# Altium project MBoard.PrjPcb (part 1 of 2)
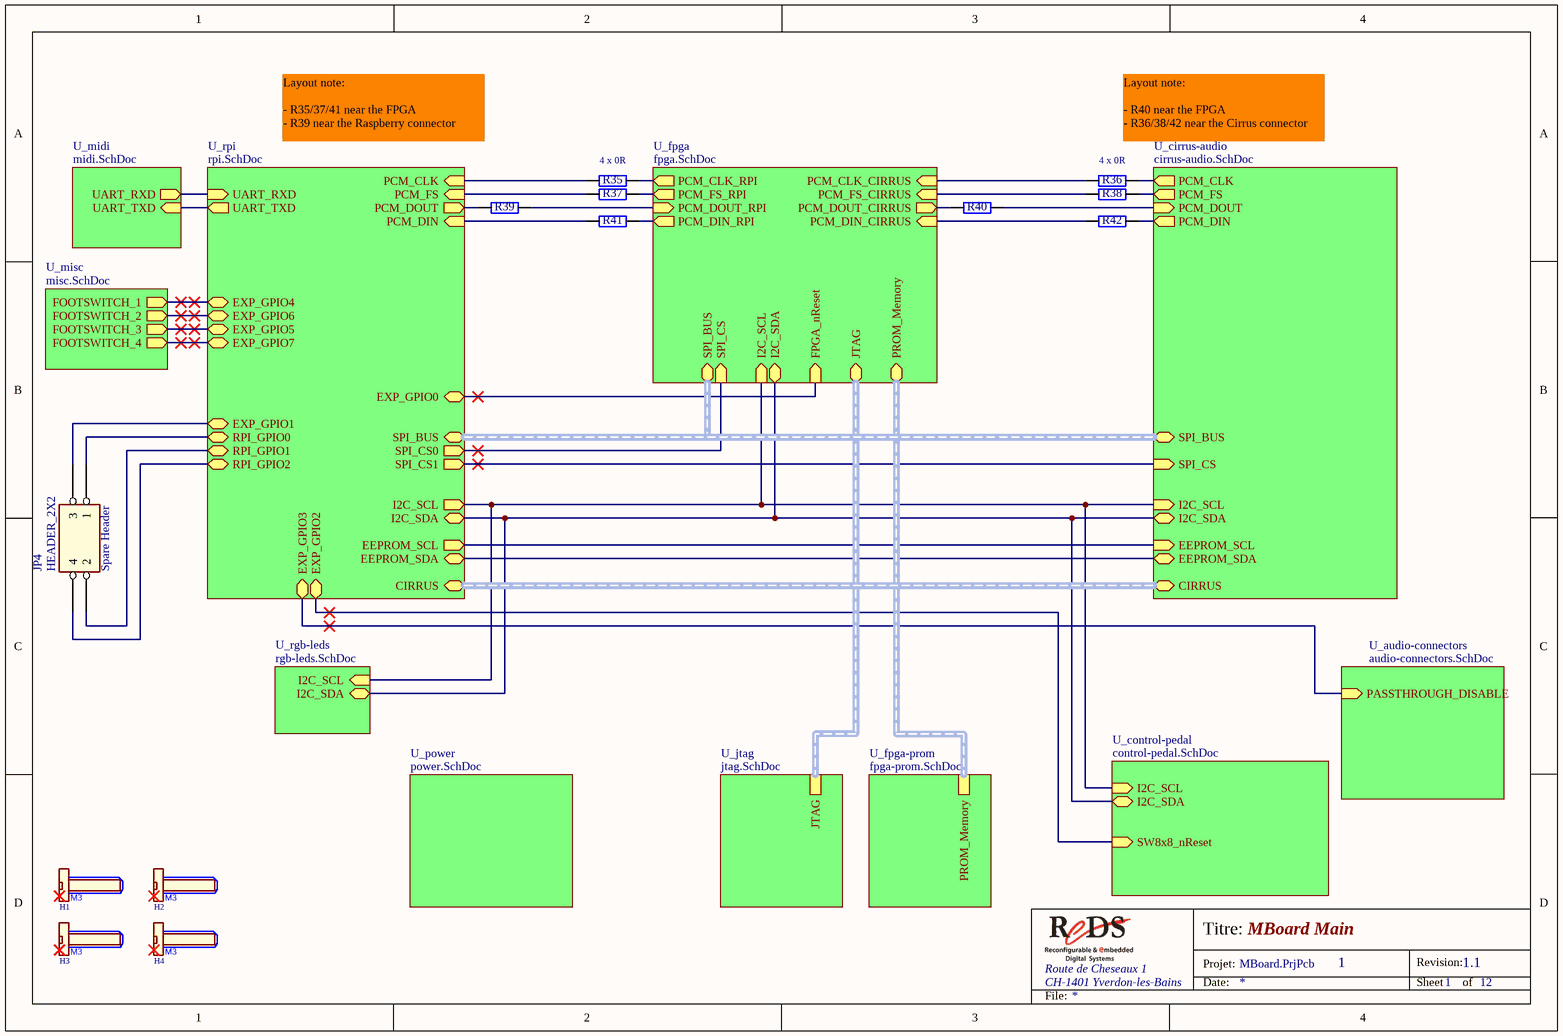
[diagram p0: mboard.SchDoc]
12 sheets, 202 parts. Net scope: hierarchical (ports join the sheet entries above them; power ports are global).
Board file: MBoard.PcbDoc
Sheets:
  mboard.SchDoc
    U_rpi = rpi.SchDoc
    U_fpga = fpga.SchDoc
    U_cirrus-audio = cirrus-audio.SchDoc
    U_midi = midi.SchDoc
    U_power = power.SchDoc
    U_control-pedal = control-pedal.SchDoc
    U_fpga-prom = fpga-prom.SchDoc
    U_jtag = jtag.SchDoc
    U_misc = misc.SchDoc
    U_audio-connectors = audio-connectors.SchDoc
    U_rgb-leds = rgb-leds.SchDoc

## Sheet mboard.SchDoc: MBoard Main
size A4; Organization: heig-vd; Address1: heig-vd; Address2: Route de Cheseaux 1; Address3: 1401 Yverdon-les-Bains; Address4: Suisse; DocumentNumber: 1; Revision: 1.1; SheetNumber: 1; SheetTotal: 12

### Parts
H1  M3  [HOLE_3.2MM - No Plated]  (value not drawn)  (no BOM)
H2  M3  [HOLE_3.2MM - No Plated]  (value not drawn)  (no BOM)
H3  M3  [HOLE_3.2MM - No Plated]  (value not drawn)  (no BOM)
H4  M3  [HOLE_3.2MM - No Plated]  (value not drawn)  (no BOM)
JP4  HEADER_2X2  [BLKCON.100/VH/TM2OE/W.200/2]  (no BOM)
R35  0R  [SM/R_0603]  (value not drawn)
R36  0R  [SM/R_0603]  (value not drawn)
R37  0R  [SM/R_0603]  (value not drawn)
R38  0R  [SM/R_0603]  (value not drawn)
R39  0R  [SM/R_0603]  (value not drawn)
R40  0R  [SM/R_0603]  (value not drawn)
R41  0R  [SM/R_0603]  (value not drawn)
R42  0R  [SM/R_0603]  (value not drawn)

### Sub-sheets
U_audio-connectors = audio-connectors.SchDoc: PASSTHROUGH_DISABLE (in)
U_cirrus-audio = cirrus-audio.SchDoc: I2C_SDA (bidir), I2C_SCL (in), SPI_CS (in), PCM_DIN (out), PCM_DOUT (in), EEPROM_SDA (bidir), EEPROM_SCL (in), CIRRUS (harness CIRRUS_CTL), SPI_BUS (harness SPI), PCM_FS (out), PCM_CLK (out)
U_control-pedal = control-pedal.SchDoc: I2C_SDA (bidir), I2C_SCL (in), SW8x8_nReset (in)
U_fpga = fpga.SchDoc: I2C_SDA (bidir), I2C_SCL (in), SPI_CS (in), PCM_DIN_RPI (out), PCM_DOUT_RPI (in), PCM_DIN_CIRRUS (in), PCM_DOUT_CIRRUS (out), FPGA_nReset (in), JTAG (harness JTAG), PROM_Memory (harness PROM_Memory), SPI_BUS (harness SPI), PCM_FS_CIRRUS (in), PCM_CLK_RPI (out), PCM_CLK_CIRRUS (in), PCM_FS_RPI (out)
U_fpga-prom = fpga-prom.SchDoc: PROM_Memory (harness PROM_Memory)
U_jtag = jtag.SchDoc: JTAG (harness JTAG)
U_midi = midi.SchDoc: UART_TXD (in), UART_RXD (out)
U_misc = misc.SchDoc: FOOTSWITCH_1 (out), FOOTSWITCH_2 (out), FOOTSWITCH_4 (out), FOOTSWITCH_3 (out)
U_power = power.SchDoc: no entries
U_rgb-leds = rgb-leds.SchDoc: I2C_SCL (in), I2C_SDA (bidir)
U_rpi = rpi.SchDoc: EEPROM_SDA (bidir), UART_RXD (in), UART_TXD (out), PCM_DOUT (out), I2C_SDA (bidir), I2C_SCL (out), SPI_CS0 (out), SPI_CS1 (out), EEPROM_SCL (out), PCM_DIN (in), EXP_GPIO1 (bidir), EXP_GPIO2 (bidir), EXP_GPIO0 (bidir), EXP_GPIO3 (bidir), EXP_GPIO4 (bidir), EXP_GPIO5 (bidir), EXP_GPIO6 (bidir), EXP_GPIO7 (bidir), SPI_BUS (harness SPI), PCM_CLK (in), PCM_FS (in), CIRRUS (harness CIRRUS_CTL), RPI_GPIO2 (bidir), RPI_GPIO0 (bidir), RPI_GPIO1 (bidir)

### Nets
FPGA_nReset: sheet U_rpi/EXP_GPIO0, sheet U_fpga/FPGA_nReset
I2C_SCL: sheet U_rpi/I2C_SCL, sheet U_fpga/I2C_SCL, sheet U_cirrus-audio/I2C_SCL, sheet U_control-pedal/I2C_SCL, sheet U_rgb-leds/I2C_SCL
I2C_SDA: sheet U_rpi/I2C_SDA, sheet U_fpga/I2C_SDA, sheet U_cirrus-audio/I2C_SDA, sheet U_control-pedal/I2C_SDA, sheet U_rgb-leds/I2C_SDA
SW8x8_nReset: sheet U_rpi/EXP_GPIO2, sheet U_control-pedal/SW8x8_nReset
NetD12_2: sheet U_rpi/EXP_GPIO4, sheet U_misc/FOOTSWITCH_1
NetD13_2: sheet U_rpi/EXP_GPIO6, sheet U_misc/FOOTSWITCH_2
NetD14_2: sheet U_rpi/EXP_GPIO5, sheet U_misc/FOOTSWITCH_3
NetD15_2: sheet U_rpi/EXP_GPIO7, sheet U_misc/FOOTSWITCH_4
NetJ1_8: sheet U_rpi/UART_TXD, sheet U_midi/UART_TXD
NetJ1_10: sheet U_rpi/UART_RXD, sheet U_midi/UART_RXD
NetJ1_12: R35.1 ; sheet U_rpi/PCM_CLK
NetJ1_26: sheet U_rpi/SPI_CS1, sheet U_cirrus-audio/SPI_CS
NetJ1_29: JP4.2 ; sheet U_rpi/RPI_GPIO1
NetJ1_31: sheet U_rpi/SPI_CS0, sheet U_fpga/SPI_CS
NetJ1_32: JP4.1 ; sheet U_rpi/RPI_GPIO0
NetJ1_35: R37.1 ; sheet U_rpi/PCM_FS
NetJ1_36: JP4.4 ; sheet U_rpi/RPI_GPIO2
NetJ1_38: R41.1 ; sheet U_rpi/PCM_DIN
NetJ1_40: R39.1 ; sheet U_rpi/PCM_DOUT
NetJ2_12: R36.2 ; sheet U_cirrus-audio/PCM_CLK
NetJ2_27: sheet U_rpi/EEPROM_SDA, sheet U_cirrus-audio/EEPROM_SDA
NetJ2_28: sheet U_rpi/EEPROM_SCL, sheet U_cirrus-audio/EEPROM_SCL
NetJ2_35: R38.2 ; sheet U_cirrus-audio/PCM_FS
NetJ2_38: R42.2 ; sheet U_cirrus-audio/PCM_DIN
NetJ2_40: R40.2 ; sheet U_cirrus-audio/PCM_DOUT
NetJP4_3: JP4.3 ; sheet U_rpi/EXP_GPIO1
NetQ3_1: sheet U_rpi/EXP_GPIO3, sheet U_audio-connectors/PASSTHROUGH_DISABLE
NetR35_2: R35.2 ; sheet U_fpga/PCM_CLK_RPI
NetR36_1: R36.1 ; sheet U_fpga/PCM_CLK_CIRRUS
NetR37_2: R37.2 ; sheet U_fpga/PCM_FS_RPI
NetR38_1: R38.1 ; sheet U_fpga/PCM_FS_CIRRUS
NetR39_2: R39.2 ; sheet U_fpga/PCM_DOUT_RPI
NetR40_1: R40.1 ; sheet U_fpga/PCM_DOUT_CIRRUS
NetR41_2: R41.2 ; sheet U_fpga/PCM_DIN_RPI
NetR42_1: R42.1 ; sheet U_fpga/PCM_DIN_CIRRUS

Not connected (* = marked no-connect by the designer): H1 1(EARTH)*; H2 1(EARTH)*; H3 1(EARTH)*; H4 1(EARTH)*

### Buses and harness runs
harness sheet U_cirrus-audio/CIRRUS = sheet U_rpi/CIRRUS
harness sheet U_cirrus-audio/SPI_BUS = sheet U_fpga/SPI_BUS = sheet U_rpi/SPI_BUS
harness sheet U_fpga-prom/PROM_Memory = sheet U_fpga/PROM_Memory
harness sheet U_fpga/JTAG = sheet U_jtag/JTAG

### Notes on the sheet
- Layout note:
  - R35/37/41 near the FPGA
  - R39 near the Raspberry connector
- (near R35) 4 x 0R
- (near R36) 4 x 0R
- Layout note:
  - R40 near the FPGA
  - R36/38/42 near the Cirrus connector
- (near JP4) Spare Header
- Route de Cheseaux 1
- CH-1401 Yverdon-les-Bains
- Titre:
- Date:
- Projet:
- Revision:
- Sheet
- of
- File:

### Library data of the parts
H1-H4 = 143: Trou de fixation 3.2mm non métalisé pour vis M3; ID: 143; Component Type: Fixation M3; Value: M3; ComponentLink1Description: Datasheet; ComponentLink2Description: Supplier; RoHS Compliant1: False
JP4 = 71: Barrette double 2x2 poles 2.54mm; Manufacturer: TE Connectivity; Manufacturer P/N: 5-826632-0; ID: 71; Connector Type: Barrette 2.54mm; Component Type: Barrette 2.54mm; Supplier 1: Distrelec; Supplier Part Number 1: 122363; ComponentLink1Description: Datasheet; ComponentLink1URL: #https://www.distrelec.ch/ishop/Datasheets/eh826629_draw.pdf#; ComponentLink2Description: Supplier; ComponentLink2URL: https://www.distrelec.ch/barrette-%C3%A0-broches-50-p%C3%B4les-1p-x50/te-connectivity/5-826629-0/122354/fr; RoHS Compliant1: False
R35-R42 = 2128: Résistance 0603 100mW 1% 0R; Manufacturer: VISHAY DRALORIC; Manufacturer P/N: CRCW06030000Z0EA; ID: 2128; Voltage: 75V; Value: 0R; Component Type: Résistance; Power: 100mW; Tolerance: 1%; Supplier 1: Digi-Key; Supplier Part Number 1: 541-0.0GTR-ND; Supplier 2: Mouser; Supplier Part Number 2: 71-CRCW0603-0-E3; RoHS Compliant: True; ComponentLink1Description: Datasheet; ComponentLink1URL: #http://www.mouser.com/ds/2/427/dcrcwe3-109170.pdf#; ComponentLink2Description: Supplier; ComponentLink2URL: #http://www.digikey.fr/product-detail/fr/ERJ-2GE0R00X/P0.0JCT-ND/146726#

## Sheet rpi.SchDoc: Raspberry PI Interface
size A4; Organization: heig-vd; Address1: heig-vd; Address2: Route de Cheseaux 1; Address3: 1401 Yverdon-les-Bains; Address4: Suisse; DocumentNumber: 2; Revision: 1.1; SheetNumber: 2; SheetTotal: 12
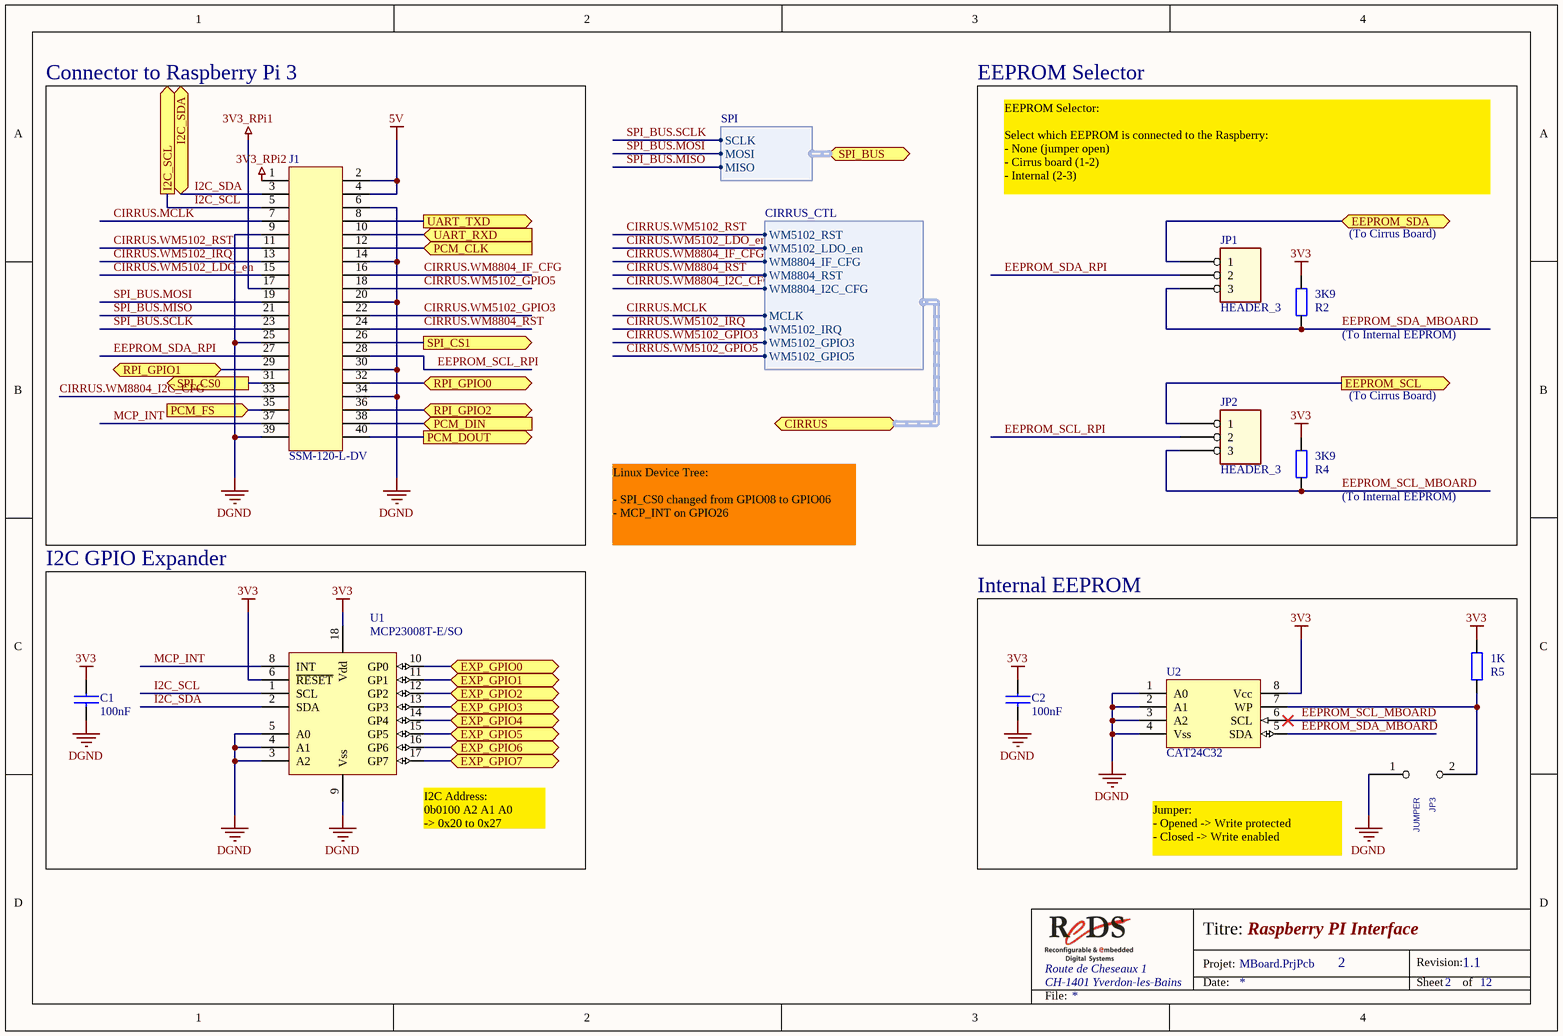
[diagram p1: rpi.SchDoc]

### Parts
C1  100nF  [SM/C_0603]
C2  100nF  [SM/C_0603]
J1  SSM-120-L-DV  [SSM-120]
JP1  HEADER_3  [BLKCON.100/VH/TM1SQ/W.100/3]
JP2  HEADER_3  [BLKCON.100/VH/TM1SQ/W.100/3]
JP3  JUMPER  [BLKCON.100/VH/TM1SQ/W.100/2]
R2  3K9  [SM/R_0603]
R4  3K9  [SM/R_0603]
R5  1K  [SM/R_0603]
U1  MCP23008T-E/SO  [SOIC-18 - W]
U2  CAT24C32  [SOIC-8 - N]

### Blocks framed on the sheet
Connector to Raspberry Pi 3: J1
EEPROM Selector: JP1 JP2 R2 R4
I2C GPIO Expander: C1 U1
Internal EEPROM: C2 JP3 R5 U2

### Ports
CIRRUS (harness CIRRUS_CTL), EEPROM_SCL (out), EEPROM_SDA (bidir), EXP_GPIO0 (bidir), EXP_GPIO1 (bidir), EXP_GPIO2 (bidir), EXP_GPIO3 (bidir), EXP_GPIO4 (bidir), EXP_GPIO5 (bidir), EXP_GPIO6 (bidir), EXP_GPIO7 (bidir), I2C_SCL (out), I2C_SDA (bidir), PCM_CLK (in), PCM_DIN (in), PCM_DOUT (out), PCM_FS (in), RPI_GPIO0 (bidir), RPI_GPIO1 (bidir), RPI_GPIO2 (bidir), SPI_BUS (harness SPI), SPI_CS0 (out), SPI_CS1 (out), UART_RXD (in), UART_TXD (out)

### Harnesses
CIRRUS_CTL: WM5102_RST, WM5102_LDO_en, WM8804_IF_CFG, WM8804_RST, WM8804_I2C_CFG, MCLK, WM5102_IRQ, WM5102_GPIO3, WM5102_GPIO5
SPI: SCLK, MOSI, MISO

### Nets
3V3: C1.1 C2.1 R2.1 R4.1 R5.1 U1.6(~{RESET}) U1.18(Vdd) U2.8(Vcc)
3V3_RPi1: J1.17
3V3_RPi2: J1.1
5V: J1.2 J1.4
DGND: C1.2 C2.2 J1.6 J1.9 J1.14 J1.20 J1.25 J1.30 J1.34 J1.39 JP3.1 U1.3(A2) U1.4(A1) U1.5(A0) U1.9(Vss) U2.1(A0) U2.2(A1) U2.3(A2) U2.4(Vss)
CIRRUS.MCLK: J1.7 ; port CIRRUS.MCLK
CIRRUS.WM5102_GPIO3: J1.22 ; port CIRRUS.WM5102_GPIO3
CIRRUS.WM5102_GPIO5: J1.18 ; port CIRRUS.WM5102_GPIO5
CIRRUS.WM5102_IRQ: J1.13 ; port CIRRUS.WM5102_IRQ
CIRRUS.WM5102_LDO_en: J1.15 ; port CIRRUS.WM5102_LDO_en
CIRRUS.WM5102_RST: J1.11 ; port CIRRUS.WM5102_RST
CIRRUS.WM8804_I2C_CFG: J1.33 ; port CIRRUS.WM8804_I2C_CFG
CIRRUS.WM8804_IF_CFG: J1.16 ; port CIRRUS.WM8804_IF_CFG
CIRRUS.WM8804_RST: J1.24 ; port CIRRUS.WM8804_RST
EEPROM_SCL_MBOARD: JP2.3 R4.2 U2.6(SCL)
EEPROM_SCL_RPI: J1.28 JP2.2
EEPROM_SDA_MBOARD: JP1.3 R2.2 U2.5(SDA)
EEPROM_SDA_RPI: J1.27 JP1.2
FPGA_nReset: U1.10(GP0) ; port EXP_GPIO0
I2C_SCL: J1.5 U1.1(SCL) ; port I2C_SCL
I2C_SDA: J1.3 U1.2(SDA) ; port I2C_SDA
MCP_INT: J1.37 U1.8(INT)
SPI_BUS.MISO: J1.21 ; port SPI_BUS.MISO
SPI_BUS.MOSI: J1.19 ; port SPI_BUS.MOSI
SPI_BUS.SCLK: J1.23 ; port SPI_BUS.SCLK
SW8x8_nReset: U1.12(GP2) ; port EXP_GPIO2
NetD12_2: U1.14(GP4) ; port EXP_GPIO4
NetD13_2: U1.16(GP6) ; port EXP_GPIO6
NetD14_2: U1.15(GP5) ; port EXP_GPIO5
NetD15_2: U1.17(GP7) ; port EXP_GPIO7
NetJ1_8: J1.8 ; port UART_TXD
NetJ1_10: J1.10 ; port UART_RXD
NetJ1_12: J1.12 ; port PCM_CLK
NetJ1_26: J1.26 ; port SPI_CS1
NetJ1_29: J1.29 ; port RPI_GPIO1
NetJ1_31: J1.31 ; port SPI_CS0
NetJ1_32: J1.32 ; port RPI_GPIO0
NetJ1_35: J1.35 ; port PCM_FS
NetJ1_36: J1.36 ; port RPI_GPIO2
NetJ1_38: J1.38 ; port PCM_DIN
NetJ1_40: J1.40 ; port PCM_DOUT
NetJ2_27: JP1.1 ; port EEPROM_SDA
NetJ2_28: JP2.1 ; port EEPROM_SCL
NetJP3_2: JP3.2 R5.2 U2.7(WP)
NetJP4_3: U1.11(GP1) ; port EXP_GPIO1
NetQ3_1: U1.13(GP3) ; port EXP_GPIO3

### Notes on the sheet
- EEPROM Selector:
  Select which EEPROM is connected to the Raspberry:
  - None (jumper open)
  - Cirrus board (1-2)
  - Internal (2-3)
- (To Cirrus Board)
- (near R2) (To Internal EEPROM)
- (near R4) (To Internal EEPROM)
- Linux Device Tree:
  - SPI_CS0 changed from GPIO08 to GPIO06
  - MCP_INT on GPIO26
- (near U1) I2C Address:
  0b0100 A2 A1 A0
  -> 0x20 to 0x27
- Jumper:
  - Opened -> Write protected
  - Closed -> Write enabled
- Route de Cheseaux 1
- CH-1401 Yverdon-les-Bains
- Titre:
- Date:
- Projet:
- Revision:
- Sheet
- of
- File:

### Library data of the parts
C1 C2 = 182: Ceramic multi-layer; Manufacturer: AVX; Manufacturer P/N: 0603YC104KAZ2A; ID: 182; Voltage: 16V; Tolerance: ±10%; Value: 100nF; Component Type: Capacitor, non-polarized; Supplier 1: Farnell; Supplier Part Number 1: 7569556; RoHS Compliant: True
J1 = SSM-120-L-DV: Mating (female) connector for the RPi 3
JP1 JP2 = 41: Barrette simple 3 poles 2.54mm; Manufacturer: TE Connectivity; Manufacturer P/N: 5-826629-0; ID: 41; Connector Type: Barrette 2.54mm; Component Type: Barrette 2.54mm; Supplier 1: Distrelec; Supplier Part Number 1: 122354; ComponentLink1Description: Datasheet; ComponentLink1URL: #https://www.distrelec.ch/ishop/Datasheets/eh826629_draw.pdf#; ComponentLink2Description: Supplier; ComponentLink2URL: https://www.distrelec.ch/barrette-%C3%A0-broches-50-p%C3%B4les-1p-x50/te-connectivity/5-826629-0/122354/fr; RoHS Compliant1: False
JP3 = 102: Barrette simple 2 poles 2.54mm; Manufacturer: TE Connectivity; Manufacturer P/N: 5-826629-0; ID: 102; Connector Type: Barrette 2.54mm; Component Type: Jumper; Supplier 1: Distrelec; Supplier Part Number 1: 122354; ComponentLink1Description: Datasheet; ComponentLink1URL: #https://www.distrelec.ch/ishop/Datasheets/eh826629_draw.pdf#; ComponentLink2Description: Supplier; ComponentLink2URL: https://www.distrelec.ch/barrette-%C3%A0-broches-50-p%C3%B4les-1p-x50/te-connectivity/5-826629-0/122354/fr; RoHS Compliant1: False
R2 R4 = 123: Résistance 0603 63mW 1% 3K9; Manufacturer: Multicomp; Manufacturer P/N: MC 0.036mW 0603 1% 3K9; ID: 123; Voltage: 50V; Value: 3K9; Component Type: Résistance; Power: 63mW; Tolerance: 1%; Supplier 1: Farnell; Supplier Part Number 1: 9331140; RoHS Compliant: False
R5 = 109: Résistance 0603 63mW 1% 1K; Manufacturer: Multicomp; Manufacturer P/N: MC 0.036mW 0603 1% 1K; ID: 109; Voltage: 50V; Value: 1K; Component Type: Résistance; Power: 63mW; Tolerance: 1%; Supplier 1: Farnell; Supplier Part Number 1: 9330380; RoHS Compliant: False
U1 = MCP23008T-E/SO: 8-Bit I/O Expander with Serial Interface (SOIC); Supplier 1: Mouser; Supplier 2: Farnell; Supplier 3: Digi-Key; Supplier 4: Arrow; Supplier Part Number 1: 579-MCP23008T-E/SO; Supplier Part Number 2: 1332086; Supplier Part Number 3: MCP23008T-E/SODKR-ND; Supplier Part Number 4: z9HrPUYC-Z_kvHyipgUSB4v0Qz4-3ABI9jppHtpV0FM
U2 = CAT24C32W: 32-Kb I2C CMOS Serial  EEPROM; Supplier 1: Farnell; Supplier 2: Mouser; Supplier 3: Newark; Supplier 4: Digi-Key; Supplier 5: Digi-Key; Supplier 6: Digi-Key; Supplier 7: Newark; Supplier 8: Farnell; Supplier 9: Arrow; Supplier 10: Mouser; Supplier 11: Arrow; Supplier Part Number 1: 1718129; Supplier Part Number 2: 698-CAT24C32WI-GT3; Supplier Part Number 3: 08R5414; Supplier Part Number 4: CAT24C32WI-GT3CT-ND; Supplier Part Number 5: CAT24C32WI-GOS-ND; Supplier Part Number 6: CAT24C32WI-GT3DKR-ND; Supplier Part Number 7: 06R0560; Supplier Part Number 8: 1631139; Supplier Part Number 9: VnlsYlhtkEtjJb7ddmB954M0cIWzK2n6cXeSPF3m92I; Supplier Part Number 10: 698-CAT24C32WI-G; Supplier Part Number 11: VnlsYlhtkEtjJb7ddmB95zFhSL4MLJyM6Ic6OekJsHY

## Sheet fpga.SchDoc: FPGA (Spartan 6)
size A3; Author: GAA; Organization: heig-vd; Address1: heig-vd; Address2: Route de Cheseaux 1; Address3: 1401 Yverdon-les-Bains; Address4: Suisse; DocumentNumber: 4; Revision: 1.1; SheetNumber: 4; SheetTotal: 12
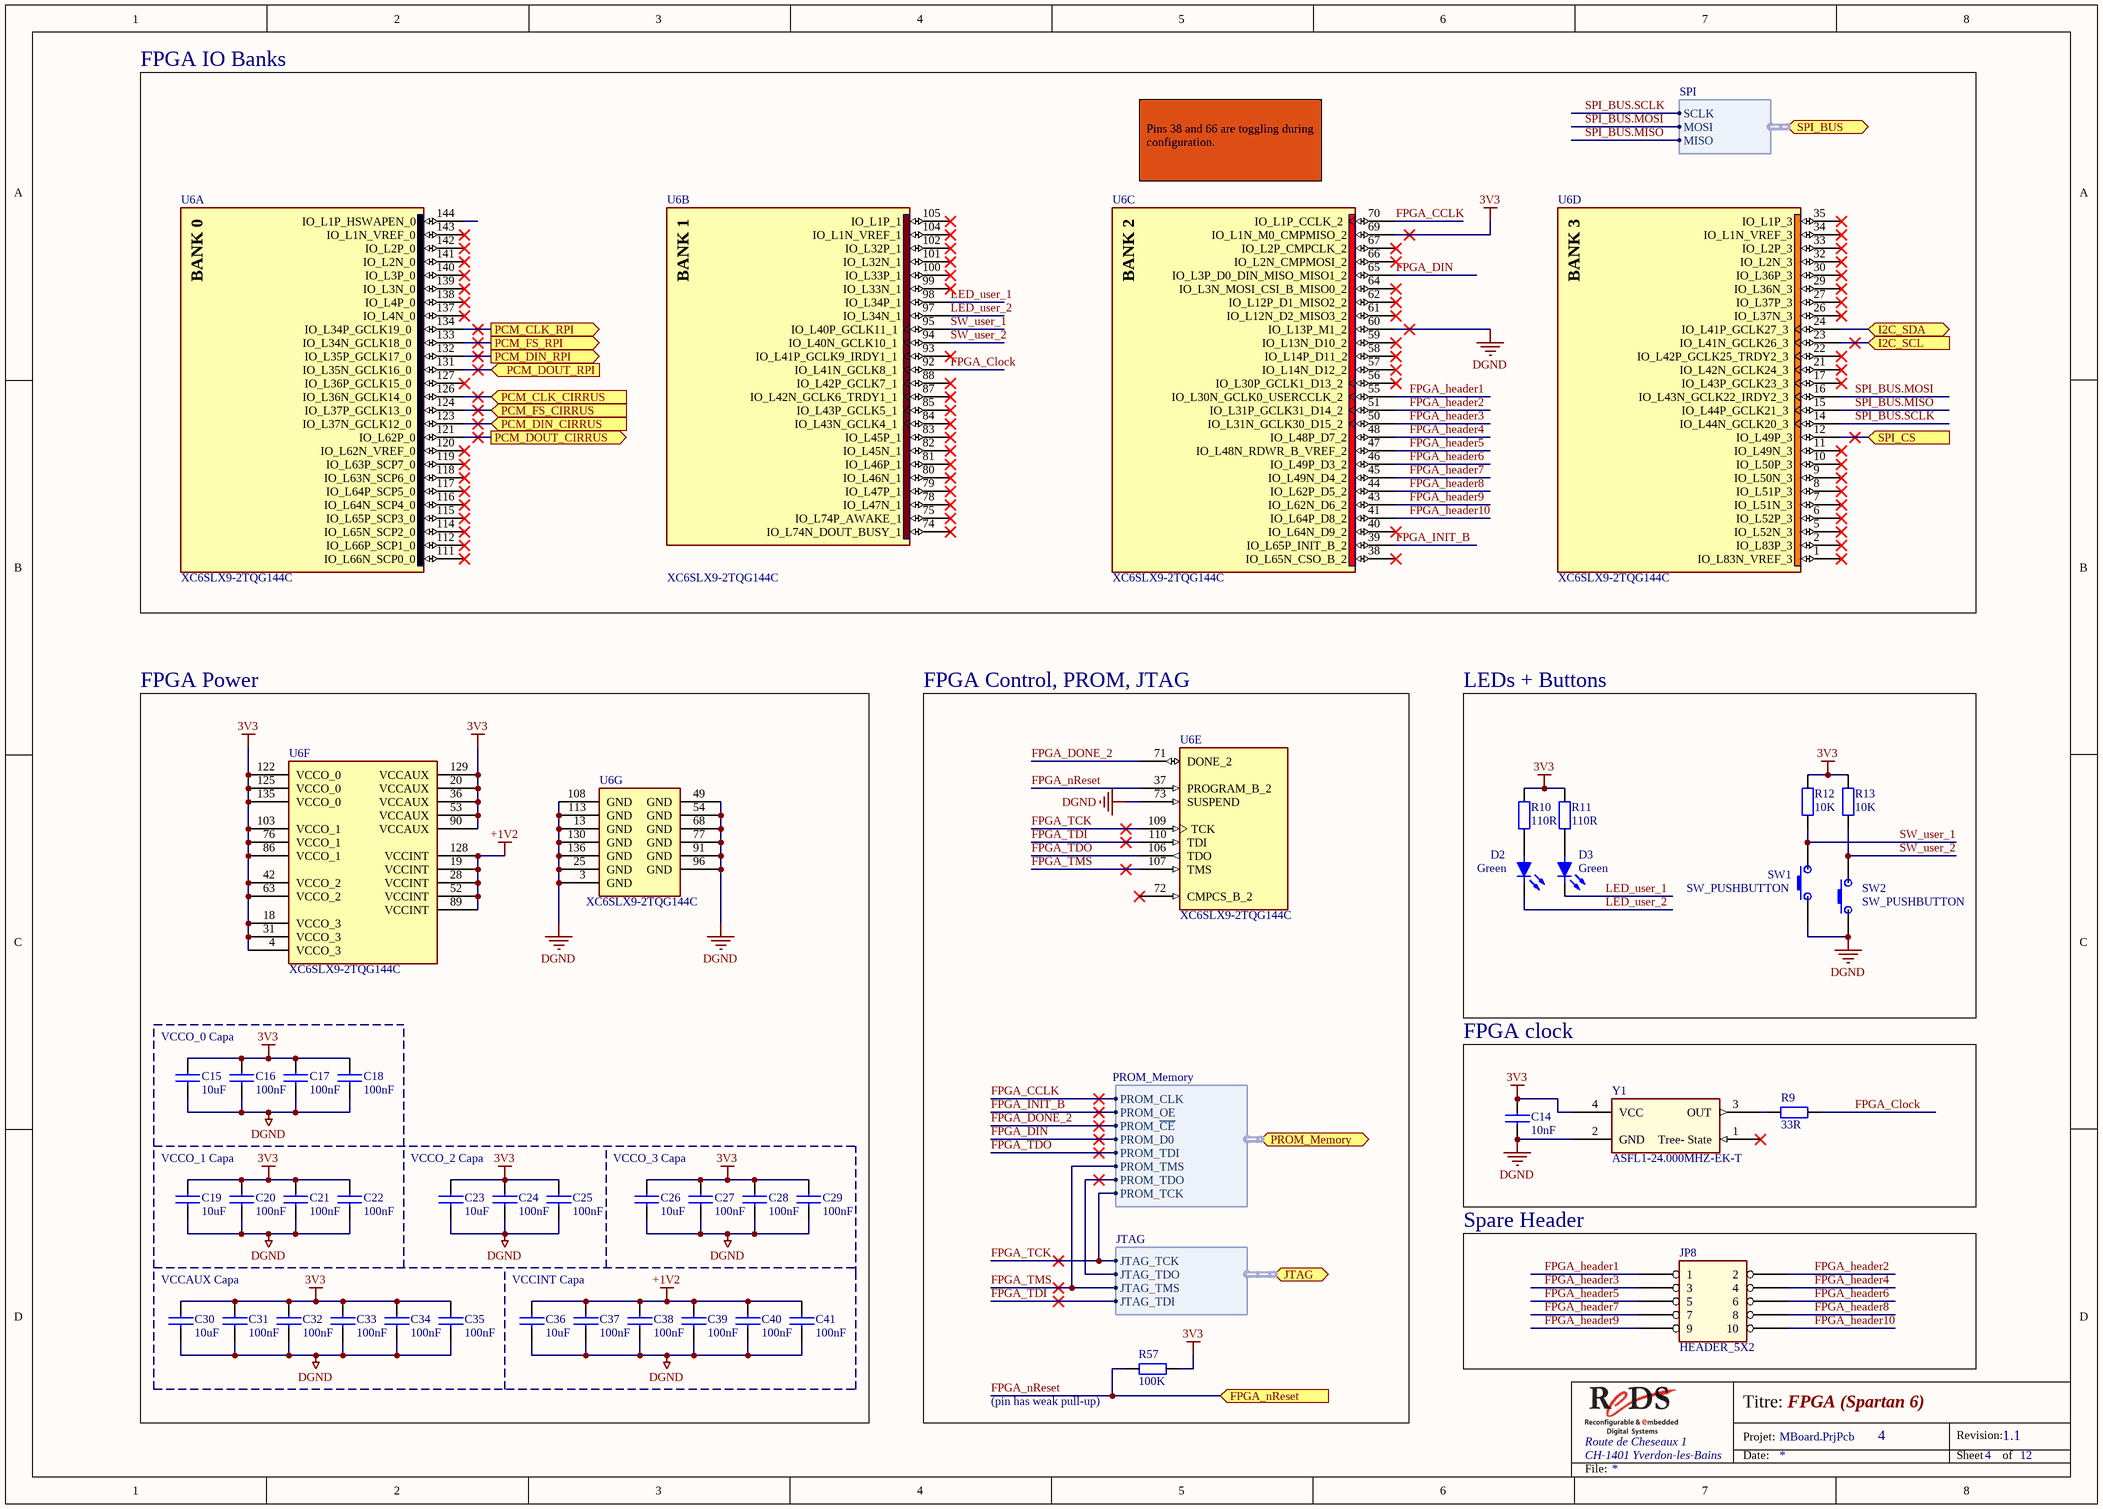
[diagram p2: fpga.SchDoc]

### Parts
C14  10nF  [SM/C_0603]
C15  10uF  [SM/C_1206]
C16  100nF  [SM/C_0603]
C17  100nF  [SM/C_0603]
C18  100nF  [SM/C_0603]
C19  10uF  [SM/C_1206]
C20  100nF  [SM/C_0603]
C21  100nF  [SM/C_0603]
C22  100nF  [SM/C_0603]
C23  10uF  [SM/C_1206]
C24  100nF  [SM/C_0603]
C25  100nF  [SM/C_0603]
C26  10uF  [SM/C_1206]
C27  100nF  [SM/C_0603]
C28  100nF  [SM/C_0603]
C29  100nF  [SM/C_0603]
C30  10uF  [SM/C_1206]
C31  100nF  [SM/C_0603]
C32  100nF  [SM/C_0603]
C33  100nF  [SM/C_0603]
C34  100nF  [SM/C_0603]
C35  100nF  [SM/C_0603]
C36  10uF  [SM/C_1206]
C37  100nF  [SM/C_0603]
C38  100nF  [SM/C_0603]
C39  100nF  [SM/C_0603]
C40  100nF  [SM/C_0603]
C41  100nF  [SM/C_0603]
D2  value Green  [PLCC_2]  (hidden comment: HSMG-A100-J02J1)
D3  value Green  [PLCC_2]  (hidden comment: HSMG-A100-J02J1)
JP8  HEADER_5X2  [BLKCON.100/VH/TM2OE/W.200/10]  (no BOM)
R9  33R  [SM/R_0603]
R10  110R  [SM/R_0603]
R11  110R  [SM/R_0603]
R12  10K  [SM/R_0603]
R13  10K  [SM/R_0603]
R57  100K  [SM/R_0603]
SW1  SW_PUSHBUTTON  [TE Connectivity_SWITCH_SERIES-FSMSM]
SW2  SW_PUSHBUTTON  [TE Connectivity_SWITCH_SERIES-FSMSM]
U6  XC6SLX9-2TQG144C  [TQFP-144]  (parts A,B,C,D,E,F,G of 7)
Y1  Manufacturer P/N: ASFL1-24.000MHZ-EK-T  [ABRACON_OSCILLATOR_ASFL1 SERIES]  (hidden comment: OSCILLATOR_2)

### Blocks framed on the sheet
FPGA IO Banks: U6
FPGA Power: C15-C41 U6
FPGA Control, PROM, JTAG: R57 U6
LEDs + Buttons: D2 D3 R10-R13 SW1 SW2
FPGA clock: C14 R9 Y1
Spare Header: JP8

### Ports
FPGA_nReset (in), I2C_SCL (in), I2C_SDA (bidir), JTAG (harness JTAG), PCM_CLK_CIRRUS (in), PCM_CLK_RPI (out), PCM_DIN_CIRRUS (in), PCM_DIN_RPI (out), PCM_DOUT_CIRRUS (out), PCM_DOUT_RPI (in), PCM_FS_CIRRUS (in), PCM_FS_RPI (out), PROM_Memory (harness PROM_Memory), SPI_BUS (harness SPI), SPI_CS (in)

### Harnesses
JTAG: JTAG_TCK, JTAG_TDI, JTAG_TDO, JTAG_TMS
PROM_Memory: PROM_CLK, PROM_OE, PROM_~{CE}, PROM_D0, PROM_TDI, PROM_TDO, PROM_TCK, PROM_TMS
SPI: SCLK, MOSI, MISO

### Nets
3V3: C14.1 C15.1 C16.1 C17.1 C18.1 C19.1 C20.1 C21.1 C22.1 C23.1 C24.1 C25.1 C26.1 C27.1 C28.1 C29.1 C30.1 C31.1 C32.1 C33.1 C34.1 C35.1 R10.1 R11.1 R12.1 R13.1 R57.2 U6.4(VCCO_3) U6.18(VCCO_3) U6.20(VCCAUX) U6.31(VCCO_3) U6.36(VCCAUX) U6.42(VCCO_2) U6.53(VCCAUX) U6.63(VCCO_2) U6.69(IO_L1N_M0_CMPMISO_2) U6.76(VCCO_1) U6.86(VCCO_1) U6.90(VCCAUX) U6.103(VCCO_1) U6.122(VCCO_0) U6.125(VCCO_0) U6.129(VCCAUX) U6.135(VCCO_0) Y1.4(VCC)
+1V2: C36.1 C37.1 C38.1 C39.1 C40.1 C41.1 U6.19(VCCINT) U6.28(VCCINT) U6.52(VCCINT) U6.89(VCCINT) U6.128(VCCINT)
DGND: C14.2 C15.2 C16.2 C17.2 C18.2 C19.2 C20.2 C21.2 C22.2 C23.2 C24.2 C25.2 C26.2 C27.2 C28.2 C29.2 C30.2 C31.2 C32.2 C33.2 C34.2 C35.2 C36.2 C37.2 C38.2 C39.2 C40.2 C41.2 SW1.1 SW2.1 U6.3(GND) U6.13(GND) U6.25(GND) U6.49(GND) U6.54(GND) U6.60(IO_L13P_M1_2) U6.68(GND) U6.73(SUSPEND) U6.77(GND) U6.91(GND) U6.96(GND) U6.108(GND) U6.113(GND) U6.130(GND) U6.136(GND) Y1.2(GND)
FPGA_CCLK: U6.70(IO_L1P_CCLK_2) ; port PROM_Memory.PROM_CLK
FPGA_Clock: R9.2 U6.92(IO_L41N_GCLK8_1)
FPGA_DIN: U6.65(IO_L3P_D0_DIN_MISO_MISO1_2) ; port PROM_Memory.PROM_D0
FPGA_DONE_2: U6.71(DONE_2) ; port PROM_Memory.PROM_~{CE}
FPGA_header1: JP8.1 U6.55(IO_L30N_GCLK0_USERCCLK_2)
FPGA_header2: JP8.2 U6.51(IO_L31P_GCLK31_D14_2)
FPGA_header3: JP8.3 U6.50(IO_L31N_GCLK30_D15_2)
FPGA_header4: JP8.4 U6.48(IO_L48P_D7_2)
FPGA_header5: JP8.5 U6.47(IO_L48N_RDWR_B_VREF_2)
FPGA_header6: JP8.6 U6.46(IO_L49P_D3_2)
FPGA_header7: JP8.7 U6.45(IO_L49N_D4_2)
FPGA_header8: JP8.8 U6.44(IO_L62P_D5_2)
FPGA_header9: JP8.9 U6.43(IO_L62N_D6_2)
FPGA_header10: JP8.10 U6.41(IO_L64P_D8_2)
FPGA_INIT_B: U6.39(IO_L65P_INIT_B_2) ; port PROM_Memory.PROM_OE
FPGA_nReset: R57.1 U6.37(PROGRAM_B_2) ; port FPGA_nReset
FPGA_TCK: U6.109(TCK) ; port JTAG.JTAG_TCK, port PROM_Memory.PROM_TCK
FPGA_TDI: U6.110(TDI) ; port JTAG.JTAG_TDI
FPGA_TDO: U6.106(TDO) ; port PROM_Memory.PROM_TDI
FPGA_TMS: U6.107(TMS) ; port JTAG.JTAG_TMS, port PROM_Memory.PROM_TMS
I2C_SCL: U6.23(IO_L41N_GCLK26_3) ; port I2C_SCL
I2C_SDA: U6.24(IO_L41P_GCLK27_3) ; port I2C_SDA
JTAG_TDO: port JTAG.JTAG_TDO, port PROM_Memory.PROM_TDO
LED_user_1: D3.2(C) U6.98(IO_L34P_1)
LED_user_2: D2.2(C) U6.97(IO_L34N_1)
SPI_BUS.MISO: U6.15(IO_L44P_GCLK21_3) ; port SPI_BUS.MISO
SPI_BUS.MOSI: U6.16(IO_L43N_GCLK22_IRDY2_3) ; port SPI_BUS.MOSI
SPI_BUS.SCLK: U6.14(IO_L44N_GCLK20_3) ; port SPI_BUS.SCLK
SW_user_1: R12.2 SW1.2 U6.95(IO_L40P_GCLK11_1)
SW_user_2: R13.2 SW2.2 U6.94(IO_L40N_GCLK10_1)
NetD2_1: D2.1(A) R10.2
NetD3_1: D3.1(A) R11.2
NetJ1_31: U6.12(IO_L49P_3) ; port SPI_CS
NetR9_1: R9.1 Y1.3(OUT)
NetR35_2: U6.134(IO_L34P_GCLK19_0) ; port PCM_CLK_RPI
NetR36_1: U6.126(IO_L36N_GCLK14_0) ; port PCM_CLK_CIRRUS
NetR37_2: U6.133(IO_L34N_GCLK18_0) ; port PCM_FS_RPI
NetR38_1: U6.124(IO_L37P_GCLK13_0) ; port PCM_FS_CIRRUS
NetR39_2: U6.131(IO_L35N_GCLK16_0) ; port PCM_DOUT_RPI
NetR40_1: U6.121(IO_L62P_0) ; port PCM_DOUT_CIRRUS
NetR41_2: U6.132(IO_L35P_GCLK17_0) ; port PCM_DIN_RPI
NetR42_1: U6.123(IO_L37N_GCLK12_0) ; port PCM_DIN_CIRRUS

Not connected (* = marked no-connect by the designer): U6 1(IO_L83N_VREF_3)* 2(IO_L83P_3)* 5(IO_L52N_3)* 6(IO_L52P_3)* 7(IO_L51N_3)* 8(IO_L51P_3)* 9(IO_L50N_3)* 10(IO_L50P_3)* 11(IO_L49N_3)* 17(IO_L43P_GCLK23_3)* 21(IO_L42N_GCLK24_3)* 22(IO_L42P_GCLK25_TRDY2_3)* 26(IO_L37N_3)* 27(IO_L37P_3)* 29(IO_L36N_3)* 30(IO_L36P_3)* 32(IO_L2N_3)* 33(IO_L2P_3)* 34(IO_L1N_VREF_3)* 35(IO_L1P_3)* 38(IO_L65N_CSO_B_2)* 40(IO_L64N_D9_2)* 56(IO_L30P_GCLK1_D13_2)* 57(IO_L14N_D12_2)* 58(IO_L14P_D11_2)* 59(IO_L13N_D10_2)* 61(IO_L12N_D2_MISO3_2)* 62(IO_L12P_D1_MISO2_2)* 64(IO_L3N_MOSI_CSI_B_MISO0_2)* 66(IO_L2N_CMPMOSI_2)* 67(IO_L2P_CMPCLK_2)* 72(CMPCS_B_2)* 74(IO_L74N_DOUT_BUSY_1)* 75(IO_L74P_AWAKE_1)* 78(IO_L47N_1)* 79(IO_L47P_1)* 80(IO_L46N_1)* 81(IO_L46P_1)* 82(IO_L45N_1)* 83(IO_L45P_1)* 84(IO_L43N_GCLK4_1)* 85(IO_L43P_GCLK5_1)* 87(IO_L42N_GCLK6_TRDY1_1)* 88(IO_L42P_GCLK7_1)* 93(IO_L41P_GCLK9_IRDY1_1)* 99(IO_L33N_1)* 100(IO_L33P_1)* 101(IO_L32N_1)* 102(IO_L32P_1)* 104(IO_L1N_VREF_1)* 105(IO_L1P_1)* 111(IO_L66N_SCP0_0)* 112(IO_L66P_SCP1_0)* 114(IO_L65N_SCP2_0)* 115(IO_L65P_SCP3_0)* 116(IO_L64N_SCP4_0)* 117(IO_L64P_SCP5_0)* 118(IO_L63N_SCP6_0)* 119(IO_L63P_SCP7_0)* 120(IO_L62N_VREF_0)* 127(IO_L36P_GCLK15_0)* 137(IO_L4N_0)* 138(IO_L4P_0)* 139(IO_L3N_0)* 140(IO_L3P_0)* 141(IO_L2N_0)* 142(IO_L2P_0)* 143(IO_L1N_VREF_0)* 144(IO_L1P_HSWAPEN_0); Y1 1(Tree-_State)*

### Notes on the sheet
- (near U6) Pins 38 and 66 are toggling during configuration.
- VCCO_0 Capa
- VCCO_1 Capa
- VCCO_2 Capa
- VCCO_3 Capa
- VCCAUX Capa
- VCCINT Capa
- (near R57) (pin has weak pull-up)
- Route de Cheseaux 1
- CH-1401 Yverdon-les-Bains
- Titre:
- Date:
- Projet:
- Revision:
- Sheet
- of
- File:
- (in symbol 2185, part A) BANK 0
- (in symbol 2185, part B) BANK 1
- (in symbol 2185, part C) BANK 2
- (in symbol 2185, part D) BANK 3

### Library data of the parts
C14 = 195: Capacitor, ceramic; Manufacturer: Kemet; Manufacturer P/N: C0603C103J5RAC-TU; ID: 195; Voltage: 50V; Tolerance: ±5%; Value: 10nF; Component Type: Capacitor, non-polarized; Supplier 1: Farnell; Supplier Part Number 1: 1650831; RoHS Compliant: True
C15 C19 C23 C26 C30 C36 = 1985: Chip Monolithic Ceramic Capacitor; Manufacturer: muRata; Manufacturer P/N: GRM31CR6YA106KA12L; ID: 1985; Voltage: 35V; Tolerance: ±10%; Value: 10uF; Component Type: Capacitor, non-polarized; Supplier 1: Farnell; Supplier Part Number 1: 1797011; Supplier 2: Digi-Key; Supplier Part Number 2: 490-5524-2-ND; RoHS Compliant: True
C16-C18 C20-C22 C24 C25 C27-C29 C31-C35 C37-C41 = 182: as C1 on sheet rpi; Value: 100nF; Component Type: Capacitor, non-polarized; Supplier 1: Farnell; Supplier Part Number 1: 7569556; RoHS Compliant: True
D2 D3 = 2254: SMT LED Green, Single Color PLCC-2 Type; Manufacturer: Broadcom/Avago; ID: 2254; Voltage: 2,2V; Component Type: Led; Manufacturer P/N: HSMG-A100-J02J1; Supplier 1: Mouser; Supplier Part Number 1: 630-HSMG-A100-J02J1; RoHS Compliant: True
JP8 = 74: Barrette double 2x5 poles 2.54mm; Manufacturer: TE Connectivity; Manufacturer P/N: 5-826632-0; ID: 74; Connector Type: Barrette 2.54mm; Component Type: Barrette 2.54mm; Supplier 1: Distrelec; Supplier Part Number 1: 122363; ComponentLink1Description: Datasheet; ComponentLink1URL: #https://www.distrelec.ch/ishop/Datasheets/eh826629_draw.pdf#; ComponentLink2Description: Supplier; ComponentLink2URL: https://www.distrelec.ch/barrette-%C3%A0-broches-50-p%C3%B4les-1p-x50/te-connectivity/5-826629-0/122354/fr; RoHS Compliant1: False
R9 = 73: Résistance 0603 63mW 1% 33R; Manufacturer: Multicomp; Manufacturer P/N: MC 0.036mW 0603 1% 33R; ID: 73; Voltage: 50V; Value: 33R; Component Type: Résistance; Power: 63mW; Tolerance: 1%; Supplier 1: Farnell; Supplier Part Number 1: 9331050; RoHS Compliant: False
R10 R11 = 86: Résistance 0603 63mW 1% 110R; Manufacturer: Multicomp; Manufacturer P/N: MC 0.036mW 0603 1% 110R; ID: 86; Voltage: 50V; Value: 110R; Component Type: Résistance; Power: 63mW; Tolerance: 1%; Supplier 1: Farnell; Supplier Part Number 1: 9330437; RoHS Compliant: False
R12 R13 = 133: Résistance 0603 63mW 1% 10K; Manufacturer: Multicomp; Manufacturer P/N: MC 0.036mW 0603 1% 10K; ID: 133; Voltage: 50V; Value: 10K; Component Type: Résistance; Power: 63mW; Tolerance: 1%; Supplier 1: Farnell; Supplier Part Number 1: 9330399; RoHS Compliant: False
R57 = 157: Résistance 0603 63mW 1% 100K; Manufacturer: Multicomp; Manufacturer P/N: MC 0.036mW 0603 1% 100K; ID: 157; Voltage: 50V; Value: 100K; Component Type: Résistance; Power: 63mW; Tolerance: 1%; Supplier 1: Farnell; Supplier Part Number 1: 9330402; RoHS Compliant: False
SW1 SW2 = 2027: SWITCH TACTILE SPST-NO 0.05A 12V; Manufacturer: TE Connectivity; Manufacturer P/N: FSMSM; ID: 2027; Component Type: SWITCH; Value: SPST-NO; Voltage: 12V; Supplier 1: Farnell; Supplier Part Number 1: 1703878; Supplier 2: Digi-Key; Supplier Part Number 2: 450-1758-1-ND; RoHS Compliant: True; ComponentLink1Description: Datasheet; ComponentLink2Description: Supplier
U6 = 2185: XC2C256 Spartan-6 LX 1.2V FPGA, 102 User I/Os, 144-Pin TQFP (0.5mm Pitch), Speed Grade 2, Commercial Grade, Pb-FreeCoolRunner-II CPLD 256-BGA; Manufacturer: Xilinx; ID: 2185; Body: 20x20mm; Component Type: IC; Manufacturer P/N: XC6SLX9-2TQG144C; Category: uP, uControleurs, Interface; Package Type: TQFP-144; Pitch: 0.5mm; Value: XC6SLX9-2TQG144C; Supplier 1: Digi-Key; Supplier Part Number 1: 122-1745-ND; RoHS Compliant: True; ComponentLink1Description: Datasheet; ComponentLink1URL: http://www.xilinx.com/support/documentation/data_sheets/ds094.pdf#; ComponentLink2Description: Supplier; ComponentLink2URL: http://www.digikey.fr/scripts/dksearch/dksus.dll?vendor=0&keywords=122-1400-ND
Y1 = 2297: Oscillateur SMD 5mmx3.2mmx0.85mm; Manufacturer: ABRACON Corporation; ID: 2297; Value: 24MHz; Voltage: 3.3V; Component Type: OSCILLATEUR; Supplier 1: Digi-Key; Supplier Part Number 1: 300-8252-1-ND; Supplier 2: Mouser; Supplier Part Number 2: 815-ASFL1-24.0-EC-T; RoHS Compliant: True; ComponentLink1Description: Datasheet; ComponentLink1URL: http://www.abracon.com/Oscillators/ASFL1.pdf; ComponentLink2Description: Supplier; ComponentLink2URL: http://www.mouser.ch/ProductDetail/ABRACON/ASFL1-24000MHZ-EC-T/?qs=%2fha2pyFaduhkDQ%2fq4itgUyHZwRZJIINyimA6uuxc3PZITTZsM6hurYP2p4lXrK0m

## Sheet cirrus-audio.SchDoc: Cirrus Audio Board
size A4; Organization: heig-vd; Address1: heig-vd; Address2: Route de Cheseaux 1; Address3: 1401 Yverdon-les-Bains; Address4: Suisse; DocumentNumber: 3; Revision: 1.1; SheetNumber: 3; SheetTotal: 12
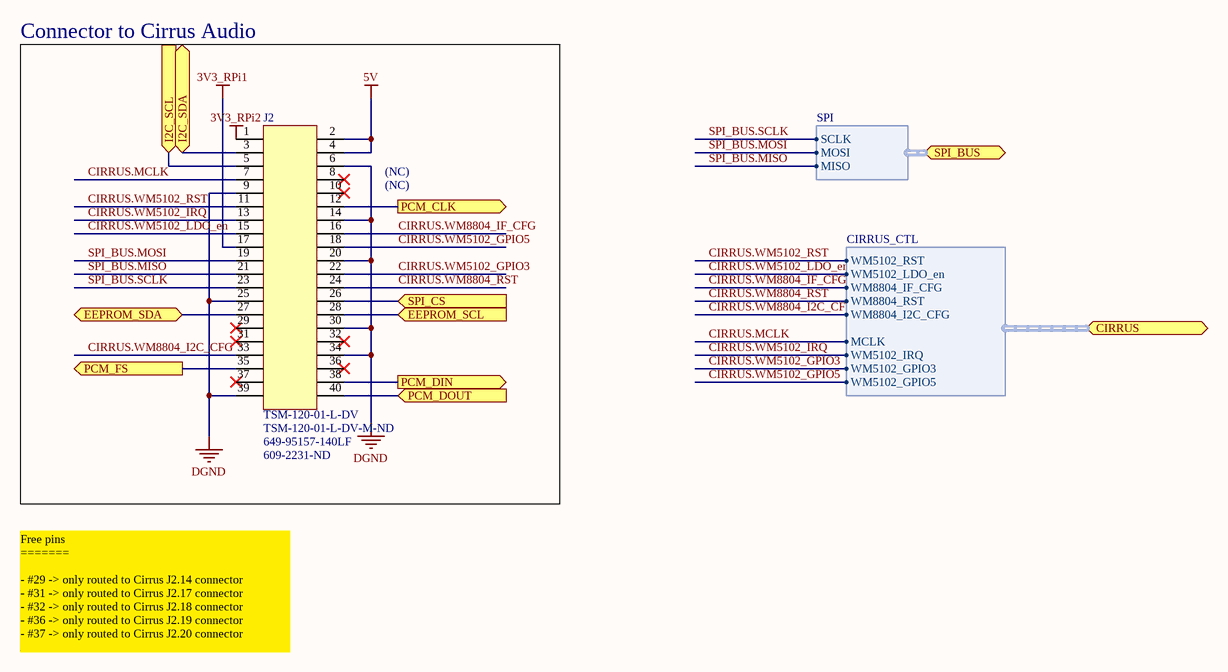
[diagram p3: cirrus-audio.SchDoc]

### Parts
J2  TSM-120-01-L-DV  Supplier Part Number 1: TSM-120-01-L-DV-M-ND  Supplier Part Number 2: 649-95157-140LF  Supplier Part Number 3: 609-2231-ND  [TSM-120-04-L-DV]

### Blocks framed on the sheet
Connector to Cirrus Audio: J2

### Ports
CIRRUS (harness CIRRUS_CTL), EEPROM_SCL (in), EEPROM_SDA (bidir), I2C_SCL (in), I2C_SDA (bidir), PCM_CLK (out), PCM_DIN (out), PCM_DOUT (in), PCM_FS (out), SPI_BUS (harness SPI), SPI_CS (in)

### Harnesses
CIRRUS_CTL: WM5102_RST, WM5102_LDO_en, WM8804_IF_CFG, WM8804_RST, WM8804_I2C_CFG, MCLK, WM5102_IRQ, WM5102_GPIO3, WM5102_GPIO5
SPI: SCLK, MOSI, MISO

### Nets
3V3_RPi1: J2.17
3V3_RPi2: J2.1
5V: J2.2 J2.4
DGND: J2.6 J2.9 J2.14 J2.20 J2.25 J2.30 J2.34 J2.39
CIRRUS.MCLK: J2.7 ; port CIRRUS.MCLK
CIRRUS.WM5102_GPIO3: J2.22 ; port CIRRUS.WM5102_GPIO3
CIRRUS.WM5102_GPIO5: J2.18 ; port CIRRUS.WM5102_GPIO5
CIRRUS.WM5102_IRQ: J2.13 ; port CIRRUS.WM5102_IRQ
CIRRUS.WM5102_LDO_en: J2.15 ; port CIRRUS.WM5102_LDO_en
CIRRUS.WM5102_RST: J2.11 ; port CIRRUS.WM5102_RST
CIRRUS.WM8804_I2C_CFG: J2.33 ; port CIRRUS.WM8804_I2C_CFG
CIRRUS.WM8804_IF_CFG: J2.16 ; port CIRRUS.WM8804_IF_CFG
CIRRUS.WM8804_RST: J2.24 ; port CIRRUS.WM8804_RST
I2C_SCL: J2.5 ; port I2C_SCL
I2C_SDA: J2.3 ; port I2C_SDA
SPI_BUS.MISO: J2.21 ; port SPI_BUS.MISO
SPI_BUS.MOSI: J2.19 ; port SPI_BUS.MOSI
SPI_BUS.SCLK: J2.23 ; port SPI_BUS.SCLK
NetJ1_26: J2.26 ; port SPI_CS
NetJ2_12: J2.12 ; port PCM_CLK
NetJ2_27: J2.27 ; port EEPROM_SDA
NetJ2_28: J2.28 ; port EEPROM_SCL
NetJ2_35: J2.35 ; port PCM_FS
NetJ2_38: J2.38 ; port PCM_DIN
NetJ2_40: J2.40 ; port PCM_DOUT

Not connected (* = marked no-connect by the designer): J2 8* 10* 29* 31* 32* 36* 37*

### Notes on the sheet
- (NC)
- Free pins
  =======
  - #29 -> only routed to Cirrus J2.14 connector
  - #31 -> only routed to Cirrus J2.17 connector
  - #32 -> only routed to Cirrus J2.18 connector
  - #36 -> only routed to Cirrus J2.19 connector
  - #37 -> only routed to Cirrus J2.20 connector
- Route de Cheseaux 1
- CH-1401 Yverdon-les-Bains
- Titre:
- Date:
- Projet:
- Revision:
- Sheet
- of
- File:

### Library data of the parts
J2 = TSM-120-01-L-DV: Mating (male) connector for the RPi 3; Supplier 1: Digi-Key; Supplier 2: Mouser; Supplier 3: Digi-Key; Supplier 4: Farnell; Supplier Part Number 4: 1915231

## Sheet midi.SchDoc: MIDI Interface
size A4; Organization: heig-vd; Address1: heig-vd; Address2: Route de Cheseaux 1; Address3: 1401 Yverdon-les-Bains; Address4: Suisse; DocumentNumber: 7; Revision: 1.1; SheetNumber: 7; SheetTotal: 12
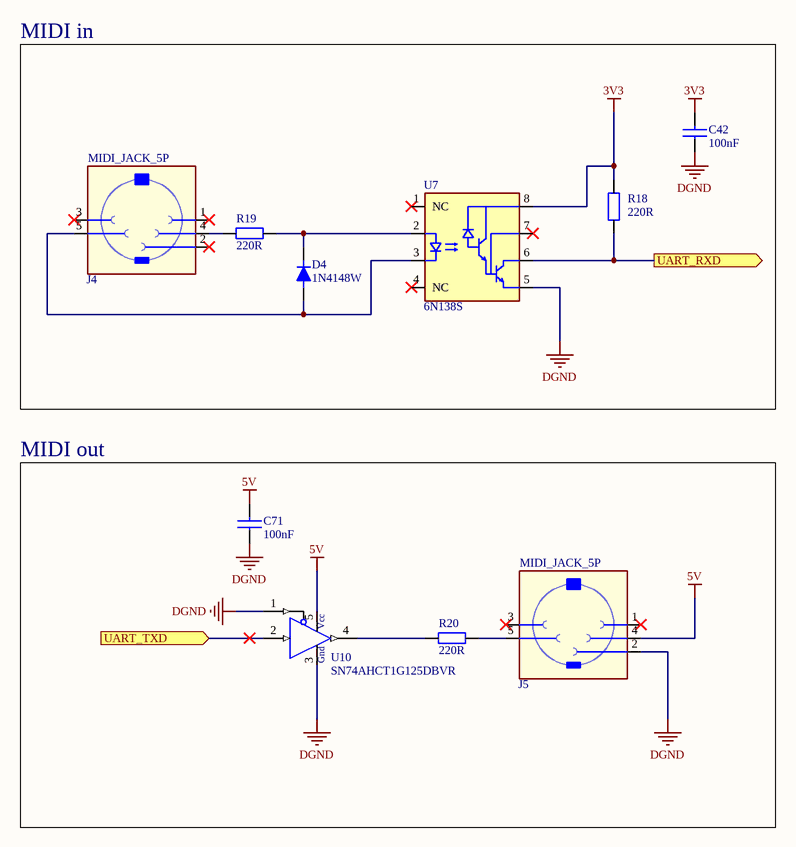
[diagram p4: midi.SchDoc]

### Parts
C42  100nF  [SM/C_0603]
C71  100nF  [SM/C_0603]
D4  value 1N4148W  [SM/D_SOD123-A1C2]  (hidden comment: Diode/A1C2)
J4  MIDI_JACK_5P  [CUI SDS-50J MiniDIN]
J5  MIDI_JACK_5P  [CUI SDS-50J MiniDIN]
R18  220R  [SM/R_0603]
R19  220R  [SM/R_0603]
R20  220R  [SM/R_0603]
U7  6N138S  [SDIP-8]
U10  SN74AHCT1G125DBVR  [SOT23-5]

### Blocks framed on the sheet
MIDI in: C42 D4 J4 R18 R19 U7
MIDI out: C71 J5 R20 U10

### Ports
UART_RXD (out), UART_TXD (in)

### Nets
3V3: C42.2 R18.1 U7.8(ALIM)
5V: C71.2 J5.4 U10.5(VCC)
DGND: C42.1 C71.1 J5.2 U7.5(GND) U10.1(~{OE}) U10.3(GND)
NetD4_1: D4.1(A) J4.5 U7.3(IN-)
NetD4_2: D4.2(C) R19.2 U7.2(IN+)
NetJ1_8: U10.2(A) ; port UART_TXD
NetJ1_10: R18.2 U7.6(Vo) ; port UART_RXD
NetJ4_4: J4.4 R19.1
NetJ5_5: J5.5 R20.2
NetR20_1: R20.1 U10.4(Y)

Not connected (* = marked no-connect by the designer): J4 1* 2* 3*; J5 1* 3*; U7 1(NC)* 4(NC)* 7(Vb)*

### Notes on the sheet
- Route de Cheseaux 1
- CH-1401 Yverdon-les-Bains
- Titre:
- Date:
- Projet:
- Revision:
- Sheet
- of
- File:
- (in symbol SN74AHCT1G125DBVR) Vcc; Gnd

### Library data of the parts
C42 C71 = 182: as C1 on sheet rpi; Value: 100nF; Component Type: Capacitor, non-polarized; Supplier 1: Farnell; Supplier Part Number 1: 7569556; RoHS Compliant: True
D4 = 2165: DIODE SWITCH 100V 0.15A; Manufacturer: Diodes Inc; Manufacturer P/N: 1N4148W-7-F; ID: 2165; Component Type: Diode; Case: SOD123; Supplier 1: Digi-Key; Supplier Part Number 1: 1N4148W-FDICT-ND; Supplier 2: Mouser; Supplier Part Number 2: 621-1N4148W-F; RoHS Compliant: True; ComponentLink1Description: Datasheet; ComponentLink1URL: http://www.mouser.com/ds/2/115/ds30086-60872.pdf; ComponentLink2Description: Supplier; ComponentLink2URL: http://www.digikey.fr/product-detail/fr/1N4148W-7-F/1N4148W-FDICT-ND/815280
J4 J5 = 349: Connecteur MIDI Jack 5 pôles; Manufacturer: CUI; Manufacturer P/N: SDS-50J; ID: 349; Component Type: Connecteur MIDI; Connector Type: MIDI_JACK 5P; Supplier 1: Digi-Key; Supplier Part Number 1: CP-2350-ND; Supplier 2: Mouser; Supplier Part Number 2: 490-SDS-50J; RoHS Compliant: False; ComponentLink1Description: Datasheet; ComponentLink1URL: http://www.mouser.com/ds/2/670/sds-xxj-535158.pdf; ComponentLink2Description: Supplier; ComponentLink2URL: http://www.mouser.ch/ProductDetail/CUI-Inc/SDS-50J/?qs=%2fha2pyFaduggidGgKudcyKY%252bmRS6WBKWhhDnjWUtbvs%3d; RoHS Compliant1: False
R18-R20 = 93: Résistance 0603 63mW 1% 220R; Manufacturer: Multicomp; Manufacturer P/N: MC 0.036mW 0603 1% 220R; ID: 93; Voltage: 50V; Value: 220R; Component Type: Résistance; Power: 63mW; Tolerance: 1%; Supplier 1: Farnell; Supplier Part Number 1: 9330801; RoHS Compliant: False
U7 = 6N138S: High Speed Optocoupler; Manufacturer: Vishay; Pitch: 2,54mm; Body: 10,16x7,62mm; Component Type: IC; Manufacturer P/N: 6N138S; Category: Ics Opto; Package Type: SOIC-8; Value: 6N138S; RoHS Compliant: True
U10 = SN74AHCT1G125DBVR: Buffers & Line Drivers Tri-State Single Bus; Manufacturer: Texas Instruments; Pitch: 0.65mm; Body: 3.15x2.9x1.3mm; Manufacturer P/N: SN74AHCT1G125DBVR; Category: ICs logiques; Package Type: SOT23-5; Value: SN74AHCT1G125; RoHS Compliant: True; Supplier 1: Digi-Key; Supplier 2: Arrow; Supplier Part Number 1: 296-4708-1-ND; Supplier Part Number 2: VJQlf-JApPy44XOFdhpFsLTwoOIB6Mwfbn24Nxqhtw8

## Sheet power.SchDoc: Power Management
size A4; Organization: heig-vd; Address1: heig-vd; Address2: Route de Cheseaux 1; Address3: 1401 Yverdon-les-Bains; Address4: Suisse; DocumentNumber: 9; Revision: 1.1; SheetNumber: 9; SheetTotal: 12
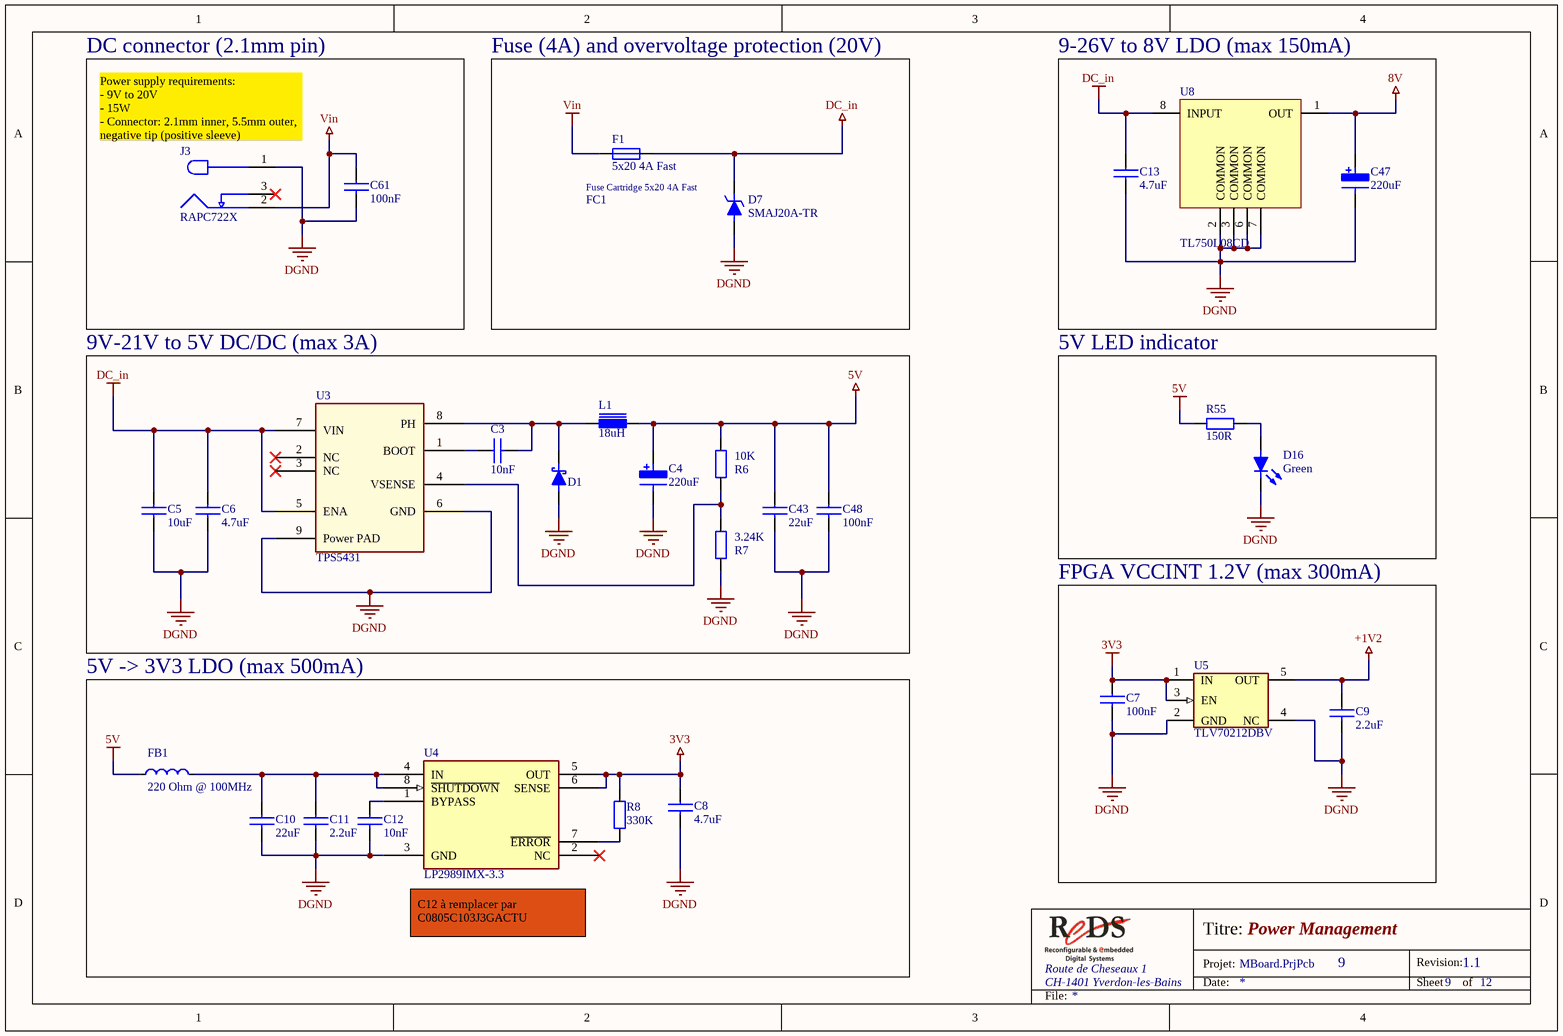
[diagram p5: power.SchDoc]

### Parts
C3  10nF  [SM/C_0603]
C4  220uF  [SM/CT_7343_12_D]
C5  10uF  [SM/C_1206]
C6  4.7uF  [SM/C_1210]
C7  100nF  [SM/C_0603]
C8  4.7uF  [SM/C_0805]
C9  2.2uF  [SM/C_0805]
C10  22uF  [SM/C_0805]
C11  2.2uF  [SM/C_0805]
C12  10nF  [SM/C_0805]
C13  4.7uF  [SM/C_1210]
C43  22uF  [SM/C_0805]
C47  220uF  [SM/CT_7343_12_D]
C48  100nF  [SM/C_0603]
C61  100nF  [SM/C_0805]
D1  B340A  [SM/D_DO214-AC (SMA)]  (value not drawn)
D7  SMAJ20A-TR  [SM/D_DO214-AC (SMA)]
D16  value Green  [S_1101F_GREEN]  (hidden comment: Led)
F1  value 5x20 4A Fast  [5x20 LittelFuse 111 50x]  (hidden comment: Fuse)
FB1  value 220 Ohm @ 100MHz  [SM/L_0805]  (hidden comment: LM21PG221SN1D)
FC1  Fuse Cartridge 5x20 4A Fast  (value not drawn)  (mechanical)
J3  RAPC722X  [RAPC722X]
L1  18uH  [BOURNS_1260]
R6  10K  [SM/R_0603]
R7  3.24K  [SM/R_0603]
R8  330K  [SM/R_0603]
R55  150R  [SM/R_0603]
U3  TPS5431  [SOIC-8 - N - Power Pad]
U4  LP2989IMX-3.3  [SOIC-8 - N]
U5  TLV70212DBV  [SOT23-5]
U8  TL750L08CD  [SOIC-8 - N]

### Blocks framed on the sheet
DC connector (2.1mm pin): C61 J3
Fuse (4A) and overvoltage protection (20V): D7 F1 FC1
9-26V to 8V LDO (max 150mA): C13 C47 U8
9V-21V to 5V DC/DC (max 3A): C3-C6 C43 C48 D1 L1 R6 R7 U3
5V LED indicator: D16 R55
FPGA VCCINT 1.2V (max 300mA): C7 C9 U5
5V -> 3V3 LDO (max 500mA): C8 C10-C12 FB1 R8 U4

### Nets
3V3: C7.1 C8.1 R8.1 U4.5(OUT) U4.6(SENSE) U5.1(IN) U5.3(EN)
5V: C4.1 C43.1 C48.1 FB1.1 L1.2 R6.1 R55.1
8V: C47.1 U8.1(OUT)
+1V2: C9.1 U5.5(OUT)
DC_in: C5.1 C6.1 C13.1 D7.2(C) F1.2 U3.5(ENA) U3.7(VIN) U8.8(INPUT)
DGND: C4.2 C5.2 C6.2 C7.2 C8.2 C9.2 C10.2 C11.2 C12.2 C13.2 C43.2 C47.2 C48.2 C61.2 D1.1(A) D7.1(A) D16.1(C) J3.1 R7.1 U3.6(GND) U3.9(Power_PAD) U4.3(GND) U5.2(GND) U5.4(NC) U8.2(COMMON) U8.3(COMMON) U8.6(COMMON) U8.7(COMMON)
Vin: C61.1 F1.1 J3.2
NetC3_1: C3.1 U3.1(BOOT)
NetC3_2: C3.2 D1.2(C) L1.1 U3.8(PH)
NetC10_1: C10.1 C11.1 FB1.2 U4.4(IN) U4.8(~{SHUTDOWN})
NetC12_1: C12.1 U4.1(BYPASS)
NetD16_2: D16.2(A) R55.2
NetR6_2: R6.2 R7.2 U3.4(VSENSE)
NetR8_2: R8.2 U4.7(~{ERROR})

Not connected (* = marked no-connect by the designer): J3 3*; U3 2(NC)* 3(NC)*; U4 2(NC)*; U8 4(NC) 5(NC)

### Notes on the sheet
- (near J3) Power supply requirements:
  - 9V to 20V
  - 15W
  - Connector: 2.1mm inner, 5.5mm outer, negative tip (positive sleeve)
- (near U4) C12 à remplacer par C0805C103J3GACTU
- Route de Cheseaux 1
- CH-1401 Yverdon-les-Bains
- Titre:
- Date:
- Projet:
- Revision:
- Sheet
- of
- File:

### Library data of the parts
C3 = 183: Ceramic multi-layer; Manufacturer: AVX; Manufacturer P/N: 06035C103KAZ2A; ID: 183; Voltage: 50V; Tolerance: ±10%; Value: 10nF; Component Type: Capacitor, non-polarized; Supplier 1: Farnell; Supplier Part Number 1: 7569548; RoHS Compliant: True
C4 C47 = CapPol: Tantalum Polymer 40mOhm ESR; Manufacturer: Panasonic; Manufacturer P/N: 10TPB220ML; Voltage: 10V; Tolerance: ±20%; Component Type: Capacitor, polarized; RoHS Compliant: True; Supplier 1: Digi-Key; Supplier Part Number 1: P16448CT-ND; Value: 220uF
C5 = 1985: as C15 on sheet fpga; Value: 10uF; Component Type: Capacitor, non-polarized; Supplier 1: Farnell; Supplier Part Number 1: 1797011; Supplier 2: Digi-Key; Supplier Part Number 2: 490-5524-2-ND; RoHS Compliant: True
C6 C13 = 2228: CONDENSATEUR 4.7UF 50V X7R 1210; Manufacturer: KEMET; Manufacturer P/N: C1210C475K5RACTU; ID: 2228; Tolerance: ± 10%; Value: 4.7uF; Component Type: Capacitor, non-polarized; Voltage: 50V; Supplier 1: Farnell; Supplier Part Number 1: 1358511; Supplier 2: Mouser; Supplier Part Number 2: 80-C1210C475K5R; RoHS Compliant: True; ComponentLink1Description: Datasheet; ComponentLink1URL: http://capacitoredge.kemet.com/capedge2/intellispec.jsp?pn=C1210C475K5RACTU&displayPN=C1210C475K5RACTU; ComponentLink2Description: Supplier; ComponentLink2URL: http://www.mouser.ch/ProductDetail/Kemet/C1210C475K5RACTU/?qs=sGAEpiMZZMs0AnBnWHyRQHl0P4nCjF4rcGD3QL%252bxV3g%3d
C7 C48 = 182: as C1 on sheet rpi; Value: 100nF; Component Type: Capacitor, non-polarized; Supplier 1: Farnell; Supplier Part Number 1: 7569556; RoHS Compliant: True
C8 = 405: Ceramic multi-layer; Manufacturer: muRata; Manufacturer P/N: GRM219R60J475KE19D; ID: 405; Voltage: 6.3V; Tolerance: ±10%; Value: 4.7uF; Component Type: Capacitor, non-polarized; Supplier 1: Farnell; Supplier Part Number 1: 9522999; RoHS Compliant: True
C9 C11 = 397: Ceramic Chip Capacitor; Manufacturer: Kemet; Manufacturer P/N: C0805C225K4RAC; ID: 397; Voltage: 16V; Tolerance: ±10%; Value: 2.2uF; Component Type: Capacitor, non-polarized; Supplier 1: Farnell; Supplier Part Number 1: 1288262; RoHS Compliant: True
C10 C43 = 398: Ceramic multi-layer; Manufacturer: Kemet; Manufacturer P/N: C0805C226M9PAC7800; ID: 398; Voltage: 6.3; Tolerance: ±20%; Value: 22uF; Component Type: Capacitor, non-polarized; Supplier 1: Farnell; Supplier Part Number 1: 1108326; RoHS Compliant: True
C12 = 2064: Ceramic Chip Capacitor; Manufacturer: Kemet; Manufacturer P/N: C0805C103K5RAC; ID: 2064; Voltage: 50V; Tolerance: ±10%; Value: 10nF; Component Type: Capacitor, non-polarized; Supplier 1: Digi-Key; Supplier Part Number 1: C0805C103K5RACTR-ND; Supplier 2: Mouser; Supplier Part Number 2: 80-C0805C103K5RAC; RoHS Compliant: True; ComponentLink1Description: Datasheet; ComponentLink1URL: #http://www.kemet.com/kemet/web/homepage/kechome.nsf/vapubfiles/KEM_C1002_X7R_SMD.pdf/$file/KEM_C1002_X7R_SMD.pdf#; ComponentLink2Description: Supplier; ComponentLink2URL: #http://www.digikey.fr/scripts/dksearch/dksus.dll?vendor=0&keywords=C0805C103K5RACTR-ND#
C61 = 395: Ceramic Chip Capacitor; Manufacturer: Kemet; Manufacturer P/N: C0805C104K5RAC7800; ID: 395; Voltage: 50V; Tolerance: ±10%; Value: 100nF; Component Type: Capacitor, non-polarized; Supplier 1: Farnell; Supplier Part Number 1: 1414664; RoHS Compliant: False
D1 = Diode Schottky B340A: DIODE SCHOTTKY 30V 3A SMA; Supplier 1: Newark; Supplier 2: Mouser; Supplier 3: Allied; Supplier 4: Arrow; Supplier 5: Farnell; Supplier 6: Digi-Key; Supplier 7: Digi-Key; Supplier Part Number 1: 12T1465; Supplier Part Number 2: 621-B340A-F; Supplier Part Number 3: 70437566; Supplier Part Number 5: 1843668; Supplier Part Number 6: B340A-FDICT-ND; Supplier Part Number 7: B340A-FDIDKR-ND
D7 = 565: Transil™ diode; Manufacturer: STMicroelectronics; ID: 565; Component Type: Diode TVS; Manufacturer P/N: SMAJ20A-TR; Value: SMAJ20A-TR; RoHS Compliant: False
D16 = Led RA Green: SMT LED, 1001F Series, Single Color Right Angle Type (3.0 X 2.0 mm); Manufacturer: Kingbright; Manufacturer P/N: APA3010ZGC-GX; Voltage: 3.3 V; Component Type: Led; RoHS Compliant: True; Supplier 1: Mouser; Supplier 2: Digi-Key; Supplier Part Number 1: 604-APA3010ZGC-GX; Supplier Part Number 2: 754-1575-1-ND
F1 = 2193: Porte-fusibles, OG ø 5 x 20 mm OG; Manufacturer: Schurter; Manufacturer P/N: 0751.0052; ID: 2193; Component Type: Porte_Fusible; Supplier 1: Distrelec; Supplier Part Number 1: 271015; Supplier 2: Mouser; Supplier Part Number 2: 693-0751.0052; RoHS Compliant: True
FB1 = 1991: PERLE DE FERRITE 0805. 220 OHMS/100MHz; Manufacturer: Murata; ID: 1991; Tolerance: ± 25%; Component Type: Ferrite; Manufacturer P/N: LM21PG221SN1D; Supplier 1: Digi-Key; Supplier Part Number 1: 490-1054-1-ND; RoHS Compliant: True
FC1 = Fuse-Cartridge: Cartridge Fuses FSF 5X20 250V 4A; Manufacturer: Schurter; Manufacturer P/N: 0034.1522; Supplier 1: Mouser; Supplier 2: Allied; Supplier 3: Digi-Key; Supplier Part Number 1: 693-0034.1522; Supplier Part Number 2: 70159906; Supplier Part Number 3: 486-1239-ND
J3 = DC plug: DC Power Connectors PCB 2.1MM; Manufacturer: SwitchCraft; Manufacturer P/N: RAPC722X; RoHS Compliant: True; Value: RAPC722X; Supplier 1: Digi-Key; Supplier 2: Allied; Supplier 3: Arrow; Supplier 4: Mouser; Supplier 5: Farnell; Supplier 6: Newark; Supplier Part Number 1: SC1313-ND; Supplier Part Number 2: 70214249; Supplier Part Number 3: blYXMuP4ttz343UuLrm15RbyFWZhgxSi-pvmLfeRSPM; Supplier Part Number 4: 502-RAPC722X; Supplier Part Number 5: 1654842; Supplier Part Number 6: 65K7786
L1 = Inductor: INDUCTOR POWER 18UH 4.2A SMD; Manufacturer: Bourns; Manufacturer P/N: SRR1260-180M; Supplier 1: Arrow; Supplier 2: Farnell; Supplier 3: Digi-Key; Supplier 4: Newark; Supplier 5: Mouser; Supplier Part Number 1: TL_AR8erWPXUZP3N6toZ0N0v_Pdy6Q30xQll4OGV_E0; Supplier Part Number 2: 1852891; Supplier Part Number 3: SRR1260-180MDKR-ND; Supplier Part Number 4: 02J3131; Supplier Part Number 5: 652-SRR1260-180M
R6 = 133: as R12 on sheet fpga; Value: 10K; Component Type: Résistance; Power: 63mW; Tolerance: 1%; Supplier 1: Farnell; Supplier Part Number 1: 9330399; RoHS Compliant: False
R7 = Res: Résistance 0603 100mW 1% 3.24K; Manufacturer: Panasonic; Manufacturer P/N: ERJ-3EKF3241V; Voltage: 75V; Value: 3.24K; Component Type: Résistance; Power: 100mW; Tolerance: 1%; RoHS Compliant: True; Supplier 1: Mouser; Supplier 2: Allied; Supplier 3: Digi-Key; Supplier 4: Arrow; Supplier 5: Newark; Supplier Part Number 1: 667-ERJ-3EKF3241V; Supplier Part Number 2: 70265773; Supplier Part Number 3: P3.24KHCT-ND; Supplier Part Number 5: 65T8426
R8 = 169: Résistance 0603 63mW 1% 330K; Manufacturer: Multicomp; Manufacturer P/N: MC 0.036mW 0603 1% 330K; ID: 169; Voltage: 50V; Value: 330K; Component Type: Résistance; Power: 63mW; Tolerance: 1%; Supplier 1: Farnell; Supplier Part Number 1: 9331042; RoHS Compliant: False
R55 = 89: Résistance 0603 63mW 1% 150R; Manufacturer: Multicomp; Manufacturer P/N: MC 0.036mW 0603 1% 150R; ID: 89; Voltage: 50V; Value: 150R; Component Type: Résistance; Power: 63mW; Tolerance: 1%; Supplier 1: Farnell; Supplier Part Number 1: 9330593; RoHS Compliant: False
U3 = TPS5431: IC REG BUCK ADJ 3A 8SO; Manufacturer: Texas Instruments; Manufacturer P/N: TPS5431DDAR; ID: 2042; Pitch: 1.27mm; Body: 5x4x1.75mm; Component Type: IC; Category: ICs analogiques linéaires; Package Type: SOIC-8; Value: TPS5431; RoHS Compliant: True; Supplier 1: Arrow; Supplier 2: Mouser; Supplier 3: Digi-Key; Supplier Part Number 1: d0f3wp0FcCwsu7PyZ1UsheiGmPJnpAWalhsyOBe_tJk; Supplier Part Number 2: 595-TPS5431DDAR; Supplier Part Number 3: 296-41750-1-ND
U4 = 2183: LP2989 500mA Linear Voltage Regulator for Digital Applications; Manufacturer: Texas Instruments; Manufacturer P/N: LP2989IMX-3.3/NOPB; ID: 2183; Pitch: 1.27mm; Body: 5x4x1.75mm; Value: LP2989MX-3.3; Component Type: IC; Category: ICs analogiques linéaires; Package Type: SOIC-8; Supplier 1: Digi-Key; Supplier Part Number 1: LP2989IMX-3.3/NOPBCT-ND; Supplier 2: Mouser; Supplier Part Number 2: 926-LP2989IMX33NOPB; RoHS Compliant: True; ComponentLink1Description: Datasheet; ComponentLink1URL: http://www.ti.com/lit/ds/symlink/lp2989.pdf; ComponentLink2Description: Supplier; ComponentLink2URL: http://www.mouser.ch/ProductDetail/Texas-Instruments/LP2989IMX-33-NOPB/?qs=sGAEpiMZZMsGz1a6aV8DcBojudwDyMGaqCTSHgR7uDw%3d
U5 = TLV70212: Régulateur LDO +1.2V, 300mA; Manufacturer: Texas Instruments; Pitch: 0.65mm; Component Type: IC; Manufacturer P/N: TLV70212DBV; Category: ICs analogiques linéaires; Package Type: SOT23-5; Value: TLV70212DBV; RoHS Compliant: True; Supplier 1: Mouser; Supplier 2: Digi-Key; Supplier 3: Farnell; Supplier 4: Arrow; Supplier Part Number 1: 595-TLV70212DBVR; Supplier Part Number 2: 296-29583-1-ND; Supplier Part Number 3: 2455686; Supplier Part Number 4: m4UZFwQuYpTafyOZsC6RDYHVEIEFGGaLKVC4VyXQD_U
U8 = TL750L08CD: Régulateur LDO +8.0V, 150mA; Manufacturer: Texas Instruments; Pitch: 1.27mm; Component Type: IC; Manufacturer P/N: TL750L08CD; Category: ICs analogiques linéaires; Package Type: SOIC; Value: TL750L08CD; RoHS Compliant: True; Supplier 1: Arrow; Supplier 2: Digi-Key; Supplier 3: Mouser; Supplier Part Number 1: ptwpRgI95fu-x3X5RzoczI1OkBIGrgz1E6z2s0uSeOY; Supplier Part Number 2: 296-8004-5-ND; Supplier Part Number 3: 595-TL750L08CDR

## Sheet control-pedal.SchDoc: Control Pedal Interface
size A4; Organization: heig-vd; Address1: heig-vd; Address2: Route de Cheseaux 1; Address3: 1401 Yverdon-les-Bains; Address4: Suisse; DocumentNumber: 8; Revision: 1.1; SheetNumber: 8; SheetTotal: 12
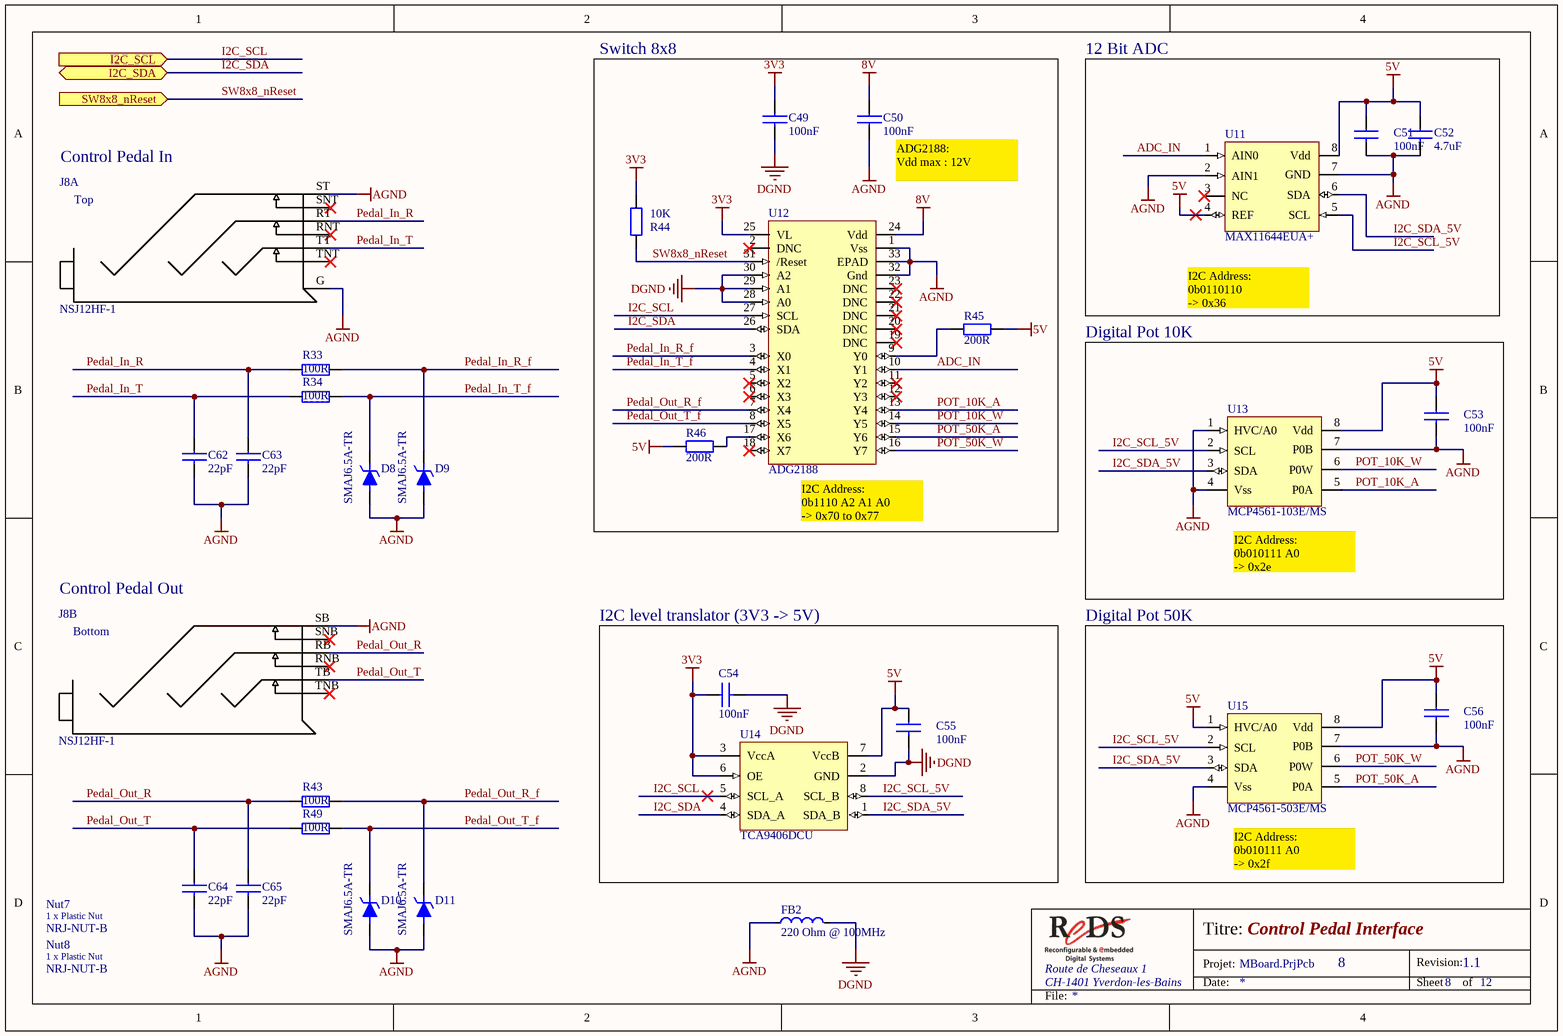
[diagram p6: control-pedal.SchDoc]

### Parts
C49  100nF  [SM/C_0603]
C50  100nF  [SM/C_0603]
C51  100nF  [SM/C_0603]
C52  4.7uF  [SM/C_0805]
C53  100nF  [SM/C_0603]
C54  100nF  [SM/C_0603]
C55  100nF  [SM/C_0603]
C56  100nF  [SM/C_0603]
C62  22pF  [SM/C_0603]
C63  22pF  [SM/C_0603]
C64  22pF  [SM/C_0603]
C65  22pF  [SM/C_0603]
D8  SMAJ6.5A-TR  [SM/D_DO214-AC (SMA)]
D9  SMAJ6.5A-TR  [SM/D_DO214-AC (SMA)]
D10  SMAJ6.5A-TR  [SM/D_DO214-AC (SMA)]
D11  SMAJ6.5A-TR  [SM/D_DO214-AC (SMA)]
FB2  value 220 Ohm @ 100MHz  [SM/L_0805]  (hidden comment: LM21PG221SN1D)
J8  NSJ12HF-1  [NSJ12HF-1]  (parts A,B of 2)
Nut7  NRJ-NUT-B  (mechanical)
Nut8  NRJ-NUT-B  (mechanical)
R33  100R  [SM/R_0603]
R34  100R  [SM/R_0603]
R43  100R  [SM/R_0603]
R44  10K  [SM/R_0603]
R45  200R  [SM/R_0603]
R46  200R  [SM/R_0603]
R49  100R  [SM/R_0603]
U11  MAX11644EUA+  [uMAX-8]
U12  ADG2188  [VFQFN-32_(32-Lead LFCSP_VQ)]
U13  MCP4561-103E/MS  [MSOP-8]
U14  TCA9406DCU  [VSSOP-8]
U15  MCP4561-503E/MS  [MSOP-8]

### Blocks framed on the sheet
Switch 8x8: C49 C50 R44-R46 U12
12 Bit ADC: C51 C52 U11
Digital Pot 10K: C53 U13
I2C level translator (3V3 -> 5V): C54 C55 U14
Digital Pot 50K: C56 U15

### Ports
I2C_SCL (in), I2C_SDA (bidir), SW8x8_nReset (in)

### Nets
3V3: C49.1 C54.1 R44.1 U12.25(VL) U14.3(VccA) U14.6(OE)
5V: C51.1 C52.1 C53.1 C55.1 C56.1 R45.2 R46.1 U11.4(REF) U11.8(Vdd) U13.8(Vdd) U14.7(VccB) U15.1(HVC/A0) U15.8(Vdd)
8V: C50.1 U12.24(Vdd)
AGND: C50.2 C51.2 C52.2 C53.2 C56.2 C62.2 C63.2 C64.2 C65.2 D8.1(A) D9.1(A) D10.1(A) D11.1(A) FB2.1 J8.G J8.SB J8.ST U11.2(AIN1) U11.7(GND) U12.1(Vss) U12.32(Gnd) U12.33(EPAD) U13.1(HVC/A0) U13.4(Vss) U13.7(P0B) U15.4(Vss) U15.7(P0B)
DGND: C49.2 C54.2 C55.2 FB2.2 U12.28(A0) U12.29(A1) U12.30(A2) U14.2(GND)
ADC_IN: U11.1(AIN0) U12.10(Y1)
I2C_SCL: U12.27(SCL) U14.5(SCL_A) ; port I2C_SCL
I2C_SCL_5V: U11.5(SCL) U13.2(SCL) U14.8(SCL_B) U15.2(SCL)
I2C_SDA: U12.26(SDA) U14.4(SDA_A) ; port I2C_SDA
I2C_SDA_5V: U11.6(SDA) U13.3(SDA) U14.1(SDA_B) U15.3(SDA)
Pedal_In_R: C63.1 J8.RT R33.1
Pedal_In_R_f: D9.2(C) R33.2 U12.3(X0)
Pedal_In_T: C62.1 J8.TT R34.1
Pedal_In_T_f: D8.2(C) R34.2 U12.4(X1)
Pedal_Out_R: C65.1 J8.RB R43.1
Pedal_Out_R_f: D11.2(C) R43.2 U12.7(X4)
Pedal_Out_T: C64.1 J8.TB R49.1
Pedal_Out_T_f: D10.2(C) R49.2 U12.8(X5)
POT_10K_A: U12.13(Y4) U13.5(P0A)
POT_10K_W: U12.14(Y5) U13.6(P0W)
POT_50K_A: U12.15(Y6) U15.5(P0A)
POT_50K_W: U12.16(Y7) U15.6(P0W)
SW8x8_nReset: R44.2 U12.31(/Reset) ; port SW8x8_nReset
NetR45_1: R45.1 U12.9(Y0)
NetR46_2: R46.2 U12.17(X6)

Not connected (* = marked no-connect by the designer): J8 RNB* RNT* SNB* SNT* TNB* TNT*; U11 3(NC)*; U12 2(DNC)* 5(X2)* 6(X3)* 11(Y2)* 12(Y3)* 18(X7)* 19(DNC)* 20(DNC)* 21(DNC)* 22(DNC)* 23(DNC)*

### Notes on the sheet
- Control Pedal In
- (near C50) ADG2188:
  Vdd max : 12V
- (near U11) I2C Address:
  0b0110110
  -> 0x36
- (near U12) I2C Address:
  0b1110 A2 A1 A0
  -> 0x70 to 0x77
- (near U13) I2C Address:
  0b010111 A0
  -> 0x2e
- Control Pedal Out
- (near U15) I2C Address:
  0b010111 A0
  -> 0x2f
- Route de Cheseaux 1
- CH-1401 Yverdon-les-Bains
- Titre:
- Date:
- Projet:
- Revision:
- Sheet
- of
- File:
- (in symbol Jack 6.35 NSJ12HF-1, part A) Top
- (in symbol Jack 6.35 NSJ12HF-1, part B) Bottom
- (in symbol Jack 6.35 Plastic Nut) 1 x Plastic Nut

### Library data of the parts
C49-C51 C53-C56 = 182: as C1 on sheet rpi; Value: 100nF; Component Type: Capacitor, non-polarized; Supplier 1: Farnell; Supplier Part Number 1: 7569556; RoHS Compliant: True
C52 = 405: as C8 on sheet power; Value: 4.7uF; Component Type: Capacitor, non-polarized; Supplier 1: Farnell; Supplier Part Number 1: 9522999; RoHS Compliant: True
C62-C65 = 216: Capacitor, ceramic; Manufacturer: Kemet; Manufacturer P/N: C0603C220J5GAC; ID: 216; Voltage: 50V; Tolerance: ±5%; Value: 22pF; Component Type: Capacitor, non-polarized; Supplier 1: Farnell; Supplier Part Number 1: 1414622; RoHS Compliant: True
D8-D11 = 558: Transil™ diode; Manufacturer: STMicroelectronics; ID: 558; Component Type: Diode TVS; Manufacturer P/N: SMAJ6.5A-TR; Value: SMAJ6.5A-TR; Supplier 1: Farnell; Supplier Part Number 1: 1749312; RoHS Compliant: False
FB2 = 1991: as FB1 on sheet power; Component Type: Ferrite; Manufacturer P/N: LM21PG221SN1D; Supplier 1: Digi-Key; Supplier Part Number 1: 490-1054-1-ND; RoHS Compliant: True
J8 = Jack 6.35 NSJ12HF-1: Neutronik 2xJack 6.35 connector; Supplier 1: Allied; Supplier 2: Newark; Supplier 3: Mouser; Supplier Part Number 1: 70549361; Supplier Part Number 2: 10J0817; Supplier Part Number 3: 568-NSJ12HF-1
Nut7 Nut8 = Jack 6.35 Plastic Nut: Plastic Nut to fasten 6.35 jack; Manufacturer: Neutrik; Manufacturer P/N: NRJ-NUT-B; Supplier 1: Mouser; Supplier 2: Allied; Supplier Part Number 1: 550-1005; Supplier Part Number 2: 70088339
R33 R34 R43 R49 = 85: Résistance 0603 63mW 1% 100R; Manufacturer: Multicomp; Manufacturer P/N: MC 0.036mW 0603 1% 100R; ID: 85; Voltage: 50V; Value: 100R; Component Type: Résistance; Power: 63mW; Tolerance: 1%; Supplier 1: Farnell; Supplier Part Number 1: 9330364; RoHS Compliant: False
R44 = 133: as R12 on sheet fpga; Value: 10K; Component Type: Résistance; Power: 63mW; Tolerance: 1%; Supplier 1: Farnell; Supplier Part Number 1: 9330399; RoHS Compliant: False
R45 R46 = 92: Résistance 0603 63mW 1% 200R; Manufacturer: Multicomp; Manufacturer P/N: MC 0.036mW 0603 1% 200R; ID: 92; Voltage: 50V; Value: 200R; Component Type: Résistance; Power: 63mW; Tolerance: 1%; Supplier 1: Farnell; Supplier Part Number 1: 9330755; RoHS Compliant: False
U11 = MAX11644: ADC 12Bit I2C; Supplier 1: Digi-Key; Supplier Part Number 1: MAX11644EUA+-ND
U12 = ADG2188: Switch 8x8
U13 = MCP4561-103E/MS: I2C Digital pot 10K; Supplier 1: Digi-Key; Supplier 2: Arrow; Supplier Part Number 1: MCP4561-103E/MS-ND; Supplier Part Number 2: lpxp5-gz8NvOdK2CvBd4ZmtK0HMy7y-wCK48FmQm7X4
U14 = TCA9406: I2C Voltage level translator; Supplier 1: Arrow; Supplier 2: Digi-Key; Supplier Part Number 1: PK32Fc7LI8q2iMXYHZWqHxYKLTLCH2B1ORNgaiWt9EM; Supplier Part Number 2: 296-28109-1-ND
U15 = MCP4561-503E/MS: I2C Digital pot 50K; Supplier 1: Digi-Key; Supplier 2: Arrow; Supplier Part Number 1: MCP4561-503E/MS-ND; Supplier Part Number 2: lpxp5-gz8NvOdK2CvBd4ZtM6b7sy6fNNyje9_7_wP3c